# EAGLE design moire_v1.6 (EAGLE 9.2.0)

## Sheet 1 of 2
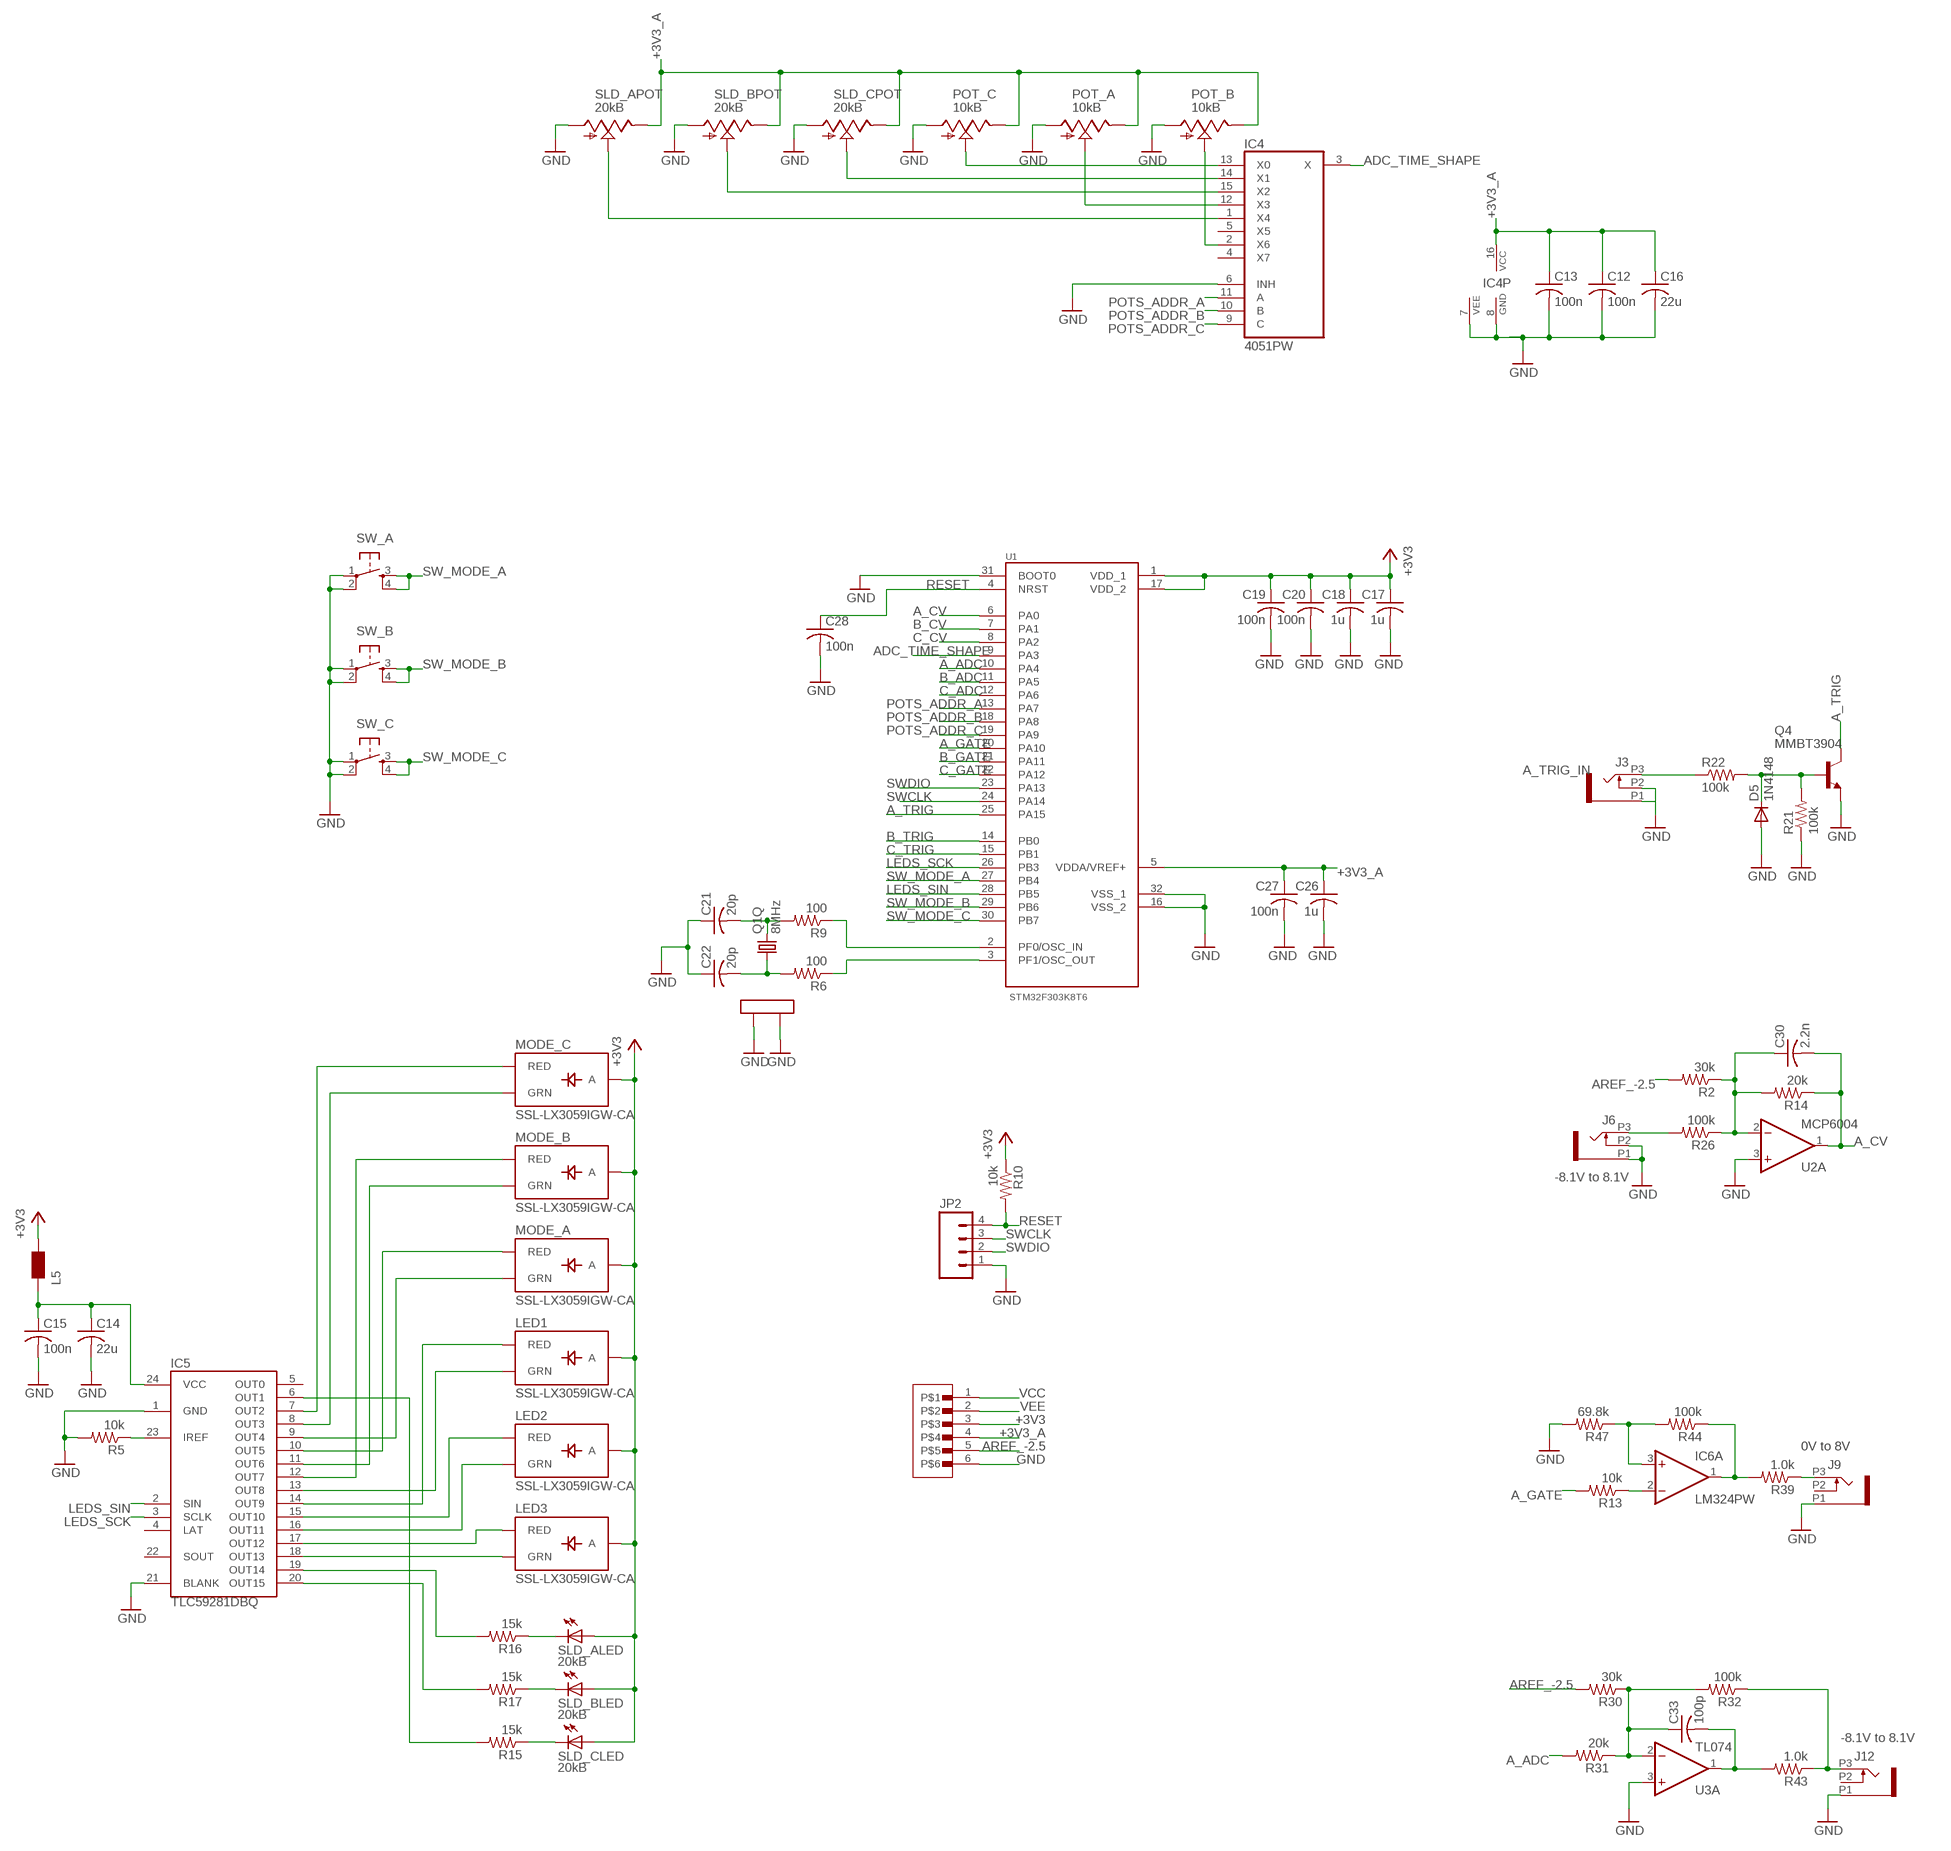
[diagram p0: schematic, sheet 1, part 1 of 2]
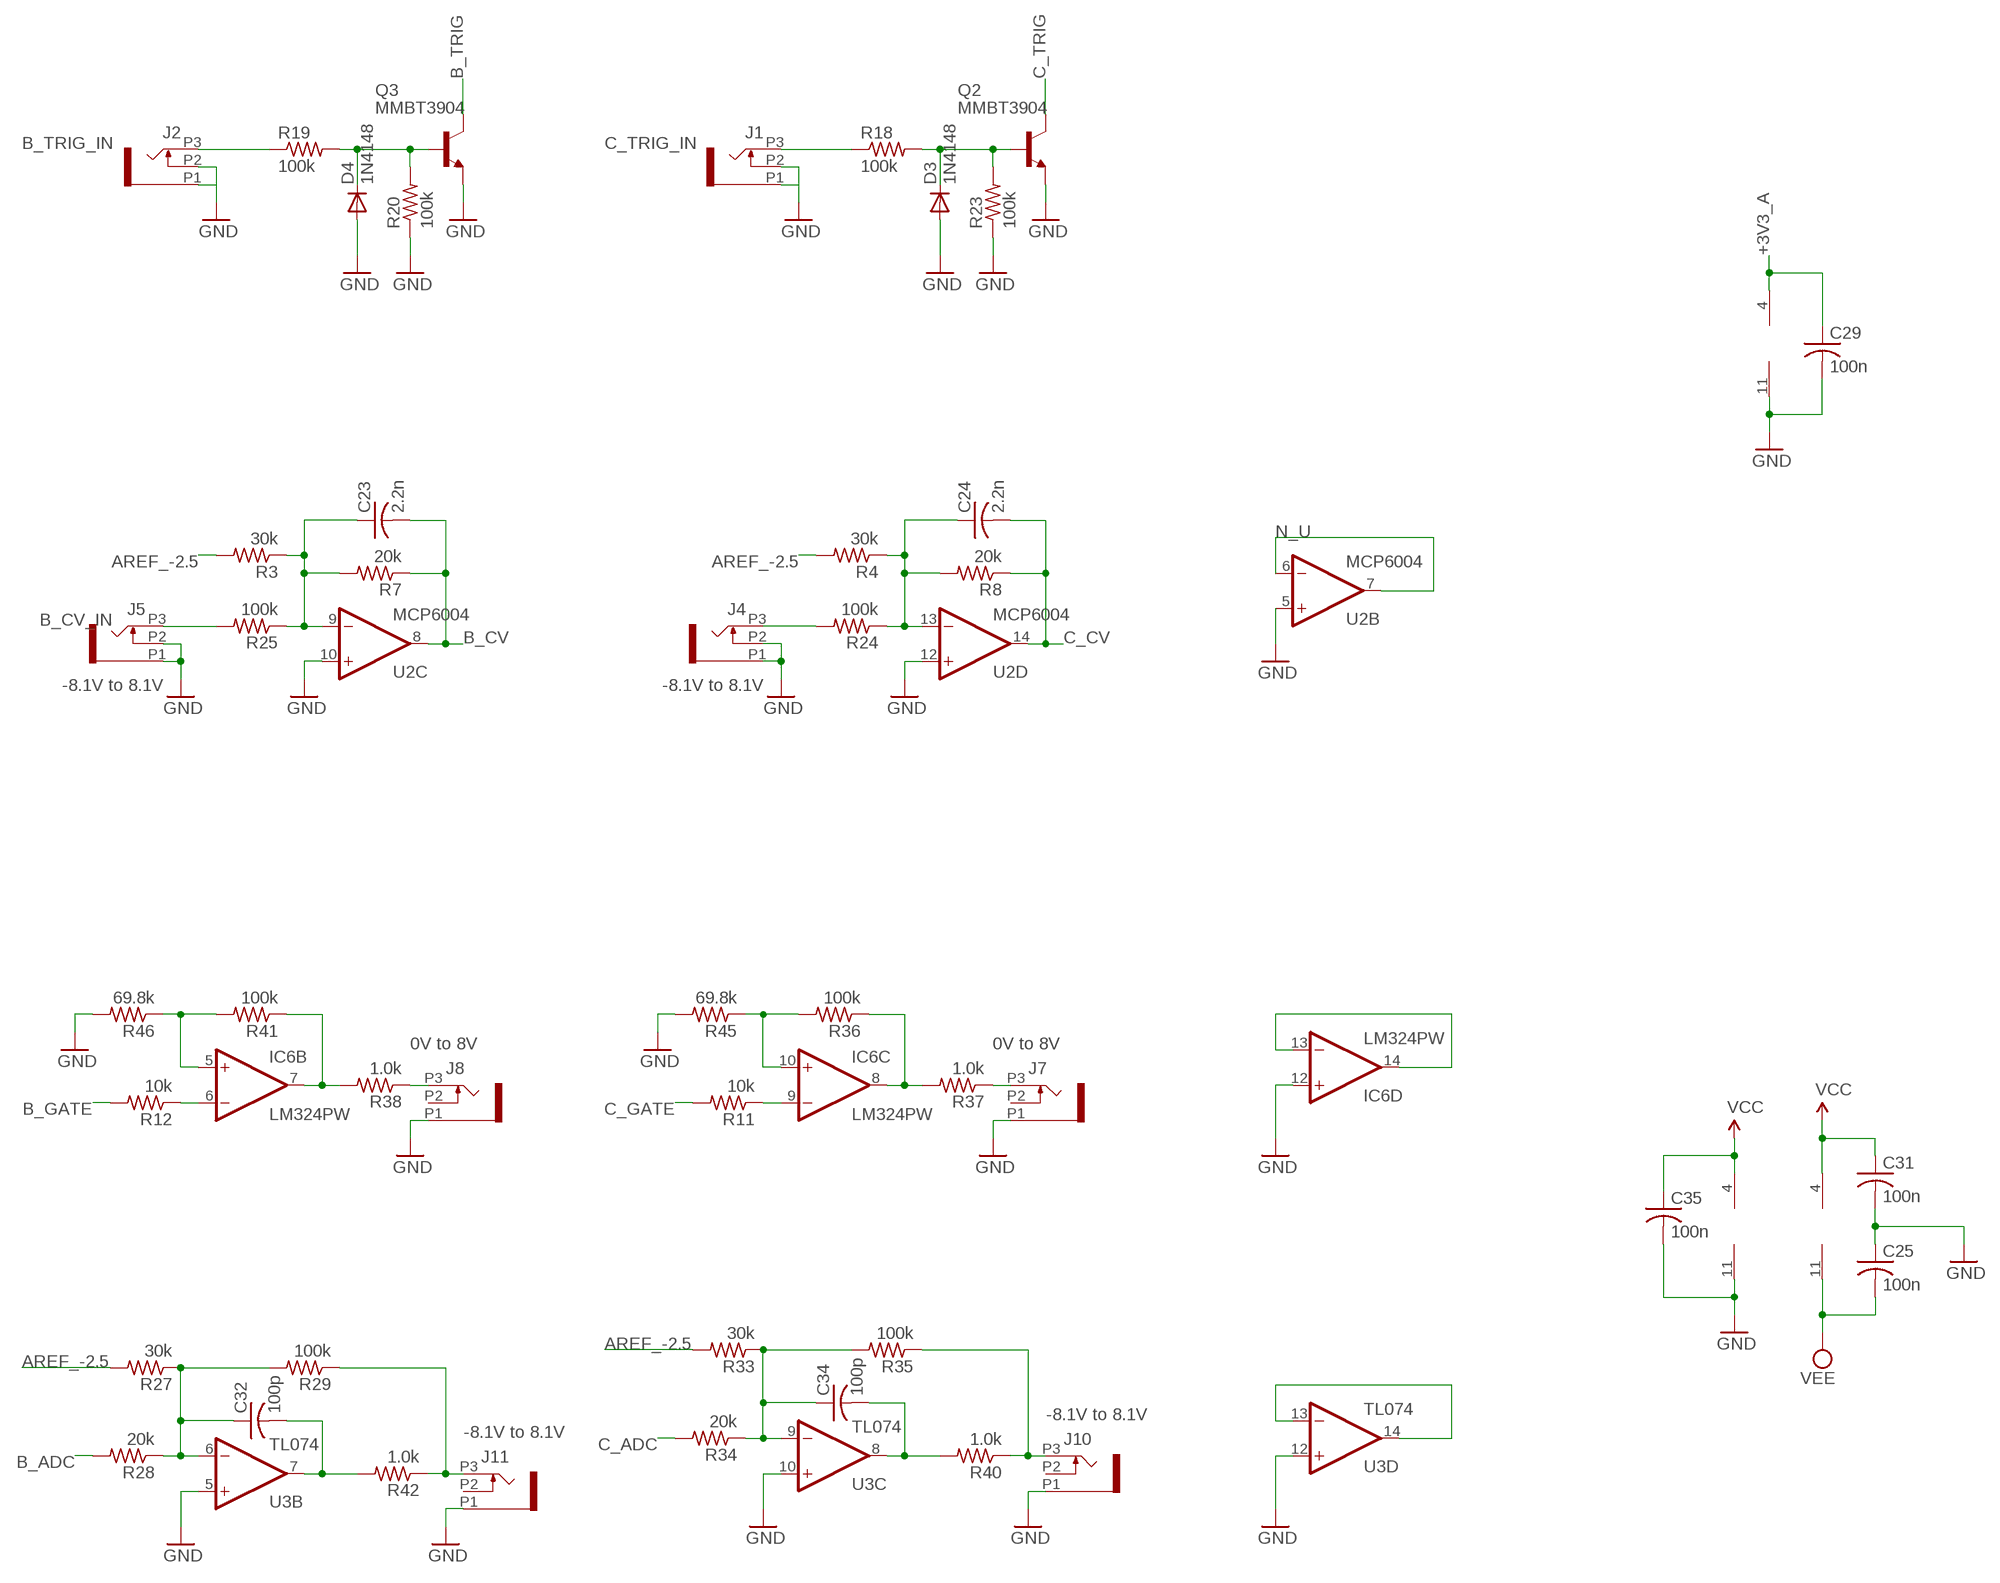
[diagram p1: schematic, sheet 1, part 2 of 2]

### Parts
C12  100n  RCL_C-USC0603  [RCL_C0603]
C13  100n  RCL_C-USC0603  [RCL_C0603]
C14  22u  RCL_C-USC1206  [RCL_C1206]
C15  100n  RCL_C-USC0603  [RCL_C0603]
C16  22u  RCL_C-USC1206  [RCL_C1206]
C17  1u  RCL_C-USC0603  [RCL_C0603]
C18  1u  RCL_C-USC0603  [RCL_C0603]
C19  100n  RCL_C-USC0603  [RCL_C0603]
C20  100n  RCL_C-USC0603  [RCL_C0603]
C21  20p  RCL_C-USC0603  [RCL_C0603]
C22  20p  RCL_C-USC0603  [RCL_C0603]
C23  2.2n  RCL_C-USC0603  [RCL_C0603]
C24  2.2n  RCL_C-USC0603  [RCL_C0603]
C25  100n  RCL_C-USC0603  [RCL_C0603]
C26  1u  RCL_C-USC0603  [RCL_C0603]
C27  100n  RCL_C-USC0603  [RCL_C0603]
C28  100n  RCL_C-USC0603  [RCL_C0603]
C29  100n  RCL_C-USC0603  [RCL_C0603]
C30  2.2n  RCL_C-USC0603  [RCL_C0603]
C31  100n  RCL_C-USC0603  [RCL_C0603]
C32  100p  RCL_C-USC0603  [RCL_C0603]
C33  100p  RCL_C-USC0603  [RCL_C0603]
C34  100p  RCL_C-USC0603  [RCL_C0603]
C35  100n  RCL_C-USC0603  [RCL_C0603]
D3  1N4148  DIODE-SOD523  [SOD523]
D4  1N4148  DIODE-SOD523  [SOD523]
D5  1N4148  DIODE-SOD523  [SOD523]
IC4  4051PW  [TSSOP16_065]
IC5  TLC59281DBQ  [TSSOP24_0635]
IC6  LM324PW  TL074PW  [TSSOP14_065]
J1  PJ301_THONKICONN6  [WQP_PJ_301M6]
J2  PJ301_THONKICONN6  [WQP_PJ_301M6]
J3  PJ301_THONKICONN6  [WQP_PJ_301M6]
J4  PJ301_THONKICONN6  [WQP_PJ_301M6]
J5  PJ301_THONKICONN6  [WQP_PJ_301M6]
J6  PJ301_THONKICONN6  [WQP_PJ_301M6]
J7  PJ301_THONKICONN6  [WQP_PJ_301M6]
J8  PJ301_THONKICONN6  [WQP_PJ_301M6]
J9  PJ301_THONKICONN6  [WQP_PJ_301M6]
J10  PJ301_THONKICONN6  [WQP_PJ_301M6]
J11  PJ301_THONKICONN6  [WQP_PJ_301M6]
J12  PJ301_THONKICONN6  [WQP_PJ_301M6]
JP2  M04PTH  [1X04]
L5  WE-CBF_0603  [0603]
LED1  SSL-LX3059IGW-CA  LED-BICOLOR-THROUGHHOLE-CA  [LED-BICOLOR-THROUGHHOLE-LUMEX]
LED2  SSL-LX3059IGW-CA  LED-BICOLOR-THROUGHHOLE-CA  [LED-BICOLOR-THROUGHHOLE-LUMEX]
LED3  SSL-LX3059IGW-CA  LED-BICOLOR-THROUGHHOLE-CA  [LED-BICOLOR-THROUGHHOLE-LUMEX]
MODE_A  SSL-LX3059IGW-CA  LED-BICOLOR-THROUGHHOLE-CA  [LED-BICOLOR-THROUGHHOLE-LUMEX]
MODE_B  SSL-LX3059IGW-CA  LED-BICOLOR-THROUGHHOLE-CA  [LED-BICOLOR-THROUGHHOLE-LUMEX]
MODE_C  SSL-LX3059IGW-CA  LED-BICOLOR-THROUGHHOLE-CA  [LED-BICOLOR-THROUGHHOLE-LUMEX]
POT_A  10kB  POT_USVERTICAL  [ALPS_POT_VERTICAL]
POT_B  10kB  POT_USVERTICAL  [ALPS_POT_VERTICAL]
POT_C  10kB  POT_USVERTICAL  [ALPS_POT_VERTICAL]
Q1  8MHz  CRYSTAL  [CTS406]
Q2  MMBT3904  MMBT3904LT1-NPN-SOT23-BEC  [SOT23-BEC]
Q3  MMBT3904  MMBT3904LT1-NPN-SOT23-BEC  [SOT23-BEC]
Q4  MMBT3904  MMBT3904LT1-NPN-SOT23-BEC  [SOT23-BEC]
R2  30k  RCL_R-US_R0603  [RCL_R0603]
R3  30k  RCL_R-US_R0603  [RCL_R0603]
R4  30k  RCL_R-US_R0603  [RCL_R0603]
R5  10k  RCL_R-US_R0603  [RCL_R0603]
R6  100  RCL_R-US_R0603  [RCL_R0603]
R7  20k  RCL_R-US_R0603  [RCL_R0603]
R8  20k  RCL_R-US_R0603  [RCL_R0603]
R9  100  RCL_R-US_R0603  [RCL_R0603]
R10  10k  RCL_R-US_R0603  [RCL_R0603]
R11  10k  RCL_R-US_R0603  [RCL_R0603]
R12  10k  RCL_R-US_R0603  [RCL_R0603]
R13  10k  RCL_R-US_R0603  [RCL_R0603]
R14  20k  RCL_R-US_R0603  [RCL_R0603]
R15  15k  RCL_R-US_R0603  [RCL_R0603]
R16  15k  RCL_R-US_R0603  [RCL_R0603]
R17  15k  RCL_R-US_R0603  [RCL_R0603]
R18  100k  RCL_R-US_R0603  [RCL_R0603]
R19  100k  RCL_R-US_R0603  [RCL_R0603]
R20  100k  RCL_R-US_R0603  [RCL_R0603]
R21  100k  RCL_R-US_R0603  [RCL_R0603]
R22  100k  RCL_R-US_R0603  [RCL_R0603]
R23  100k  RCL_R-US_R0603  [RCL_R0603]
R24  100k  RCL_R-US_R0603  [RCL_R0603]
R25  100k  RCL_R-US_R0603  [RCL_R0603]
R26  100k  RCL_R-US_R0603  [RCL_R0603]
R27  30k  RCL_R-US_R0603  [RCL_R0603]
R28  20k  RCL_R-US_R0603  [RCL_R0603]
R29  100k  RCL_R-US_R0603  [RCL_R0603]
R30  30k  RCL_R-US_R0603  [RCL_R0603]
R31  20k  RCL_R-US_R0603  [RCL_R0603]
R32  100k  RCL_R-US_R0603  [RCL_R0603]
R33  30k  RCL_R-US_R0603  [RCL_R0603]
R34  20k  RCL_R-US_R0603  [RCL_R0603]
R35  100k  RCL_R-US_R0603  [RCL_R0603]
R36  100k  RCL_R-US_R0603  [RCL_R0603]
R37  1.0k  RCL_R-US_R0603  [RCL_R0603]
R38  1.0k  RCL_R-US_R0603  [RCL_R0603]
R39  1.0k  RCL_R-US_R0603  [RCL_R0603]
R40  1.0k  RCL_R-US_R0603  [RCL_R0603]
R41  100k  RCL_R-US_R0603  [RCL_R0603]
R42  1.0k  RCL_R-US_R0603  [RCL_R0603]
R43  1.0k  RCL_R-US_R0603  [RCL_R0603]
R44  100k  RCL_R-US_R0603  [RCL_R0603]
R45  69.8k  RCL_R-US_R0603  [RCL_R0603]
R46  69.8k  RCL_R-US_R0603  [RCL_R0603]
R47  69.8k  RCL_R-US_R0603  [RCL_R0603]
SLD_A  20kB  BOURNS_SLIDER  [BOURNS_SLIDER]
SLD_B  20kB  BOURNS_SLIDER  [BOURNS_SLIDER]
SLD_C  20kB  BOURNS_SLIDER  [BOURNS_SLIDER]
SW_A  TAC_SWITCHPTH  [TACTILE-PTH]
SW_B  TAC_SWITCHPTH  [TACTILE-PTH]
SW_C  TAC_SWITCHPTH  [TACTILE-PTH]
U1  STM32F303K8T6  [QFP80P900X900X160-32N]
U2  MCP6004  MCP6004_SMD  [SO14]
U3  TL074  TL074_SMD  [SO14]
U$1  1X6-SMD-TESTPAD  [6X1-SMD-TESTPAD]

### Nets
+3V3 [power]: C17.1 C18.1 C19.1 C20.1 L5.2 LED1.A LED2.A LED3.A MODE_A.A MODE_B.A MODE_C.A R10.1 SLD_A.B(LED:A) SLD_B.B(LED:A) SLD_C.B(LED:A) U1.1(VDD_1) U1.17(VDD_2) U$1.3 ; also sheet 2
+3V3_A [power]: C12.1 C13.1 C16.1 C26.1 C27.1 C29.1 IC4.16(VCC) POT_A.P$1(E) POT_B.P$1(E) POT_C.P$1(E) SLD_A.3(POT:E) SLD_B.3(POT:E) SLD_C.3(POT:E) U1.5(VDDA/VREF+) U2.4(P:V+) U$1.4 ; also sheet 2
A_ADC: R31.2 U1.10(PA4)
A_CV: C30.2 R14.1 U1.6(PA0) U2.1(A:OUT)
A_GATE: R13.2 U1.20(PA10)
A_TRIG: Q4.C U1.25(PA15)
A_TRIG_IN: J3.P3 R22.1
ADC_TIME_SHAPE: IC4.3(X) U1.9(PA3)
AREF_-2.5: R2.2 R3.2 R4.2 R27.2 R30.2 R33.2 U$1.5 ; also sheet 2
B_ADC: R28.2 U1.11(PA5)
B_CV: C23.2 R7.1 U1.7(PA1) U2.8(C:OUT)
B_CV_IN: J5.P3 R25.2
B_GATE: R12.2 U1.21(PA11)
B_TRIG: Q3.C U1.14(PB0)
B_TRIG_IN: J2.P3 R19.1
C_ADC: R34.2 U1.12(PA6)
C_CV: C24.2 R8.1 U1.8(PA2) U2.14(D:OUT)
C_GATE: R11.2 U1.22(PA12)
C_TRIG: Q2.C U1.15(PB1)
C_TRIG_IN: J1.P3 R18.1
GND: C12.2 C13.2 C14.2 C15.2 C16.2 C17.2 C18.2 C19.2 C20.2 C21.1 C22.1 C25.1 C26.2 C27.2 C28.2 C29.2 C31.2 C35.2 D3.A D4.A D5.A IC4.6(INH) IC4.7(VEE) IC4.8(GND) IC5.1(GND) IC5.21(BLANK) IC6.11(P:V-) IC6.12(D:+IN) J1.P1 J1.P2 J2.P1 J2.P2 J3.P1 J3.P2 J4.P1 J4.P2 J5.P1 J5.P2 J6.P1 J6.P2 J7.P1 J8.P1 J9.P1 J10.P1 J11.P1 J12.P1 JP2.1 POT_A.P$3(A) POT_B.P$3(A) POT_C.P$3(A) Q1.2(LID1) Q1.4(LID2) Q2.E Q3.E Q4.E R5.2 R20.1 R21.1 R23.1 R45.2 R46.2 R47.2 SLD_A.1(POT:A) SLD_B.1(POT:A) SLD_C.1(POT:A) SW_A.1 SW_A.2 SW_B.1 SW_B.2 SW_C.1 SW_C.2 U1.16(VSS_2) U1.31(BOOT0) U1.32(VSS_1) U2.3(A:+IN) U2.5(B:+IN) U2.10(C:+IN) U2.11(P:V-) U2.12(D:+IN) U3.3(A:+IN) U3.5(B:+IN) U3.10(C:+IN) U3.12(D:+IN) U$1.6 ; also sheet 2
LEDS_SCK: IC5.3(SCLK) U1.26(PB3)
LEDS_SIN: IC5.2(SIN) U1.28(PB5)
N$1: R15.1 SLD_C.E(LED:C)
N$2: J9.P3 R39.1
N$6: IC6.13(D:-IN) IC6.14(D:OUT)
N$7: J11.P3 R29.1 R42.1
N$8: C32.1 R27.1 R28.1 R29.2 U3.6(B:-IN)
N$9: R9.1 U1.2(PF0/OSC_IN)
N$10: R6.1 U1.3(PF1/OSC_OUT)
N$11: C21.2 Q1.3 R9.2
N$12: C22.2 Q1.1 R6.2
N$13: J8.P3 R38.1
N$14: U3.13(D:-IN) U3.14(D:OUT)
N$15: C32.2 R42.2 U3.7(B:OUT)
N$16: IC6.1(A:OUT) R39.2 R44.1
N$17: J10.P3 R35.1 R40.1
N$18: C34.1 R33.1 R34.1 R35.2 U3.9(C:-IN)
N$19: C34.2 R40.2 U3.8(C:OUT)
N$20: J7.P3 R37.1
N$21: J4.P3 R24.2
N$22: J6.P3 R26.2
N$24: IC6.3(A:+IN) R44.2 R47.1
N$25: IC6.2(A:-IN) R13.1
N$26: IC6.7(B:OUT) R38.2 R41.1
N$28: IC6.5(B:+IN) R41.2 R46.1
N$29: IC6.6(B:-IN) R12.1
N$30: IC6.8(C:OUT) R36.1 R37.2
N$32: IC5.11(OUT6) MODE_B.GREEN_C(GRN)
N$33: IC5.10(OUT5) MODE_A.RED_C(RED)
N$34: IC5.12(OUT7) MODE_B.RED_C(RED)
N$35: IC5.7(OUT2) MODE_C.RED_C(RED)
N$36: IC5.8(OUT3) MODE_C.GREEN_C(GRN)
N$37: IC5.15(OUT10) LED2.RED_C(RED)
N$38: IC5.16(OUT11) LED2.GREEN_C(GRN)
N$39: IC5.13(OUT8) LED1.GREEN_C(GRN)
N$40: IC5.17(OUT12) LED3.RED_C(RED)
N$41: D3.C Q2.B R18.2 R23.2
N$42: IC5.18(OUT13) LED3.GREEN_C(GRN)
N$43: IC5.14(OUT9) LED1.RED_C(RED)
N$44: C14.1 C15.1 IC5.24(VCC) L5.1
N$45: IC5.19(OUT14) R16.2
N$46: IC5.20(OUT15) R17.2
N$47: IC5.6(OUT1) R15.2
N$48: IC4.1(X4) SLD_A.2(POT:S)
N$49: R17.1 SLD_B.E(LED:C)
N$50: R16.1 SLD_A.E(LED:C)
N$51: IC4.2(X6) POT_B.P$2(S)
N$53: IC4.12(X3) POT_A.P$2(S)
N$54: IC4.13(X0) POT_C.P$2(S)
N$55: IC4.14(X1) SLD_C.2(POT:S)
N$56: IC4.15(X2) SLD_B.2(POT:S)
N$57: C30.1 R2.1 R14.2 R26.1 U2.2(A:-IN)
N$58: C23.1 R3.1 R7.2 R25.1 U2.9(C:-IN)
N$59: C24.1 R4.1 R8.2 R24.1 U2.13(D:-IN)
N$61: IC6.10(C:+IN) R36.2 R45.1
N$62: D4.C Q3.B R19.2 R20.2
N$64: IC6.9(C:-IN) R11.1
N$65: D5.C Q4.B R21.2 R22.2
N$68: IC5.23(IREF) R5.1
N$86: J12.P3 R32.1 R43.1
N$87: C33.1 R30.1 R31.1 R32.2 U3.2(A:-IN)
N$93: C33.2 R43.2 U3.1(A:OUT)
N$101: IC5.9(OUT4) MODE_A.GREEN_C(GRN)
N_U: U2.6(B:-IN) U2.7(B:OUT)
POTS_ADDR_A: IC4.11(A) U1.13(PA7)
POTS_ADDR_B: IC4.10(B) U1.18(PA8)
POTS_ADDR_C: IC4.9(C) U1.19(PA9)
RESET: C28.1 JP2.4 R10.2 U1.4(NRST)
SW_MODE_A: SW_A.3 SW_A.4 U1.27(PB4)
SW_MODE_B: SW_B.3 SW_B.4 U1.29(PB6)
SW_MODE_C: SW_C.3 SW_C.4 U1.30(PB7)
SWCLK: JP2.3 U1.24(PA14)
SWDIO: JP2.2 U1.23(PA13)
VCC: C31.1 C35.1 IC6.4(P:V+) U3.4(P:V+) U$1.1 ; also sheet 2
VEE: C25.2 U3.11(P:V-) U$1.2 ; also sheet 2
Unconnected: IC4.4(X7) IC4.5(X5) IC5.4(LAT) IC5.5(OUT0) IC5.22(SOUT) J7.P2 J8.P2 J9.P2 J10.P2 J11.P2 J12.P2

### Notes on the sheet
- -8.1V to 8.1V | -8.1V to 8.1V | -8.1V to 8.1V
- 0V to 8V | 0V to 8V | 0V to 8V
- -8.1V to 8.1V
- -8.1V to 8.1V | -8.1V to 8.1V

## Sheet 2 of 2
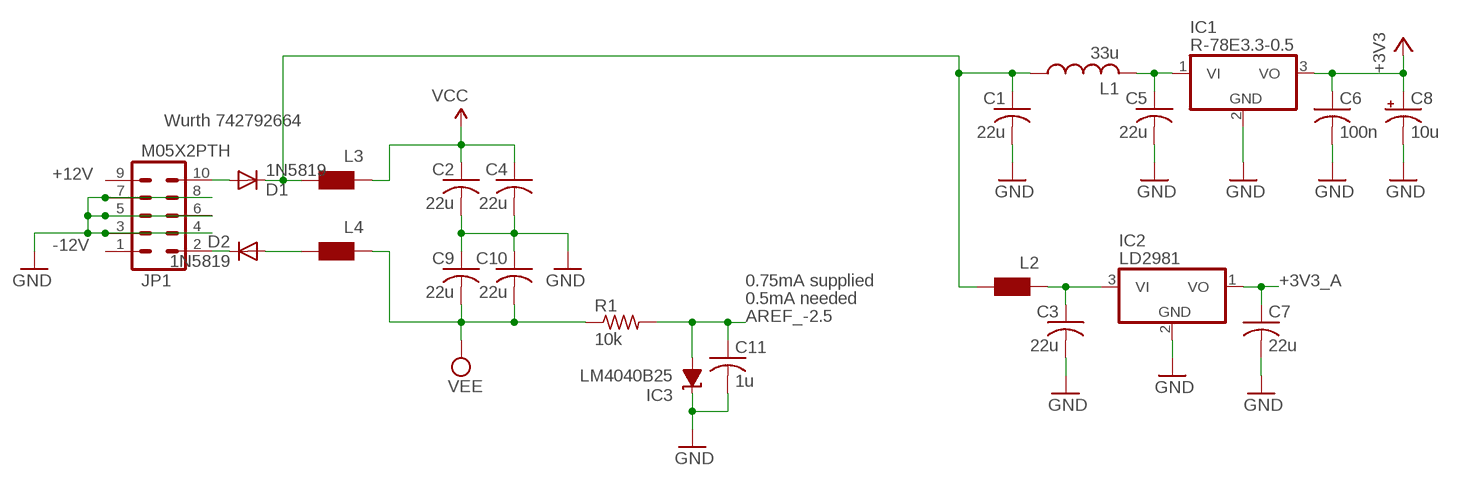
[diagram p2: schematic, sheet 2]

### Parts
C1  22u  RCL_C-USC1206  [RCL_C1206]
C2  22u  RCL_C-USC1206  [RCL_C1206]
C3  22u  RCL_C-USC1206  [RCL_C1206]
C4  22u  RCL_C-USC1206  [RCL_C1206]
C5  22u  RCL_C-USC1206  [RCL_C1206]
C6  100n  RCL_C-USC0603  [RCL_C0603]
C7  22u  RCL_C-USC1206  [RCL_C1206]
C8  10u  RCL_CPOL-USA  [RCL_PANASONIC_A]
C9  22u  RCL_C-USC1206  [RCL_C1206]
C10  22u  RCL_C-USC1206  [RCL_C1206]
C11  1u  RCL_C-USC0603  [RCL_C0603]
D1  1N5819  DIODE-SOD123  [SOD123]
D2  1N5819  DIODE-SOD123  [SOD123]
IC1  R-78E3.3-0.5  WE173950378  [WE78]
IC2  LD2981  LD2981ABU  [SOT89]
IC3  LM4040B25  LM4041B12DBZ  [DBZ_R-PDSO-G3]
JP1  M05X2PTH  [2X5-PTH]
L1  33u  L-USL2012C  [L2012C]
L2  WE-CBF_0603  [0603]
L3  WE-CBF_0603  [0603]
L4  WE-CBF_0603  [0603]
R1  10k  RCL_R-US_R0603  [RCL_R0603]

### Nets
+3V3 [power]: C6.1 C8.+ IC1.3(VO) ; also sheet 1
+3V3_A [power]: C7.1 IC2.1(VO) ; also sheet 1
+12V [power]: D1.A JP1.9 JP1.10
-12V [power]: D2.C JP1.1 JP1.2
AREF_-2.5: C11.1 IC3.2(A) R1.2 ; also sheet 1
GND: C1.2 C2.2 C3.2 C4.2 C5.2 C6.2 C7.2 C8.- C9.1 C10.1 C11.2 IC1.2(GND) IC2.2(GND) IC3.1(C) JP1.3 JP1.4 JP1.5 JP1.6 JP1.7 JP1.8 ; also sheet 1
N$3: D2.A L4.2
N$4: C1.1 D1.C L1.1 L2.2 L3.2
N$5: C3.1 IC2.3(VI) L2.1
N$66: C5.1 IC1.1(VI) L1.2
VCC: C2.1 C4.1 L3.1 ; also sheet 1
VEE: C9.2 C10.2 L4.1 R1.1 ; also sheet 1

### Notes on the sheet
- Wurth 742792664
- 0.75mA supplied
- 0.5mA needed

## Library data of the parts
C1-C7 C9-C35 = moire_v1.5-routed:RCL_C-US: CAPACITOR, American symbol
C8 = moire_v1.5-routed:RCL_CPOL-US: POLARIZED CAPACITOR, American symbol
D1-D5 = diode:DIODE-: DIODE
IC1 = og-vreg:WE173950378
IC2 = og-vreg:LD2981
IC3 = texas:LM4041: PRECISION MICROPOWER SHUNT VOLTAGE REFERENCE Source: http://focus.ti.com/lit/ds/slcs146e/slcs146e.pdf
IC4 = og-ics:4051: 8-channel ANALOG MULTIPLEXER
IC5 = og-ics:TLC59281
IC6 = og-linear:TL074: OP AMP
J1-J12 = og-pj301_variations:PJ301_THONKICONN
JP1 = og-header:M05X2: Header 5x2 Standard 10-pin dual row 0.1" header. Commonly used with AVR-ISP. Use with Spark Fun Electronics SKU: PRT-00778
JP2 = SparkFun:M04: Header 4 Standard 4-pin 0.1" header. Use with straight break away headers (SKU : PRT-00116), right angle break away headers (PRT-00553), swiss pins (PRT-00743), machine pins (PRT-00117), and female headers (PRT-00115). Molex polarized connector foot print use with SKU : PRT-08231 with associated crimp pins and housings.
L1 = og-rcl:L-US
L2-L5 = wuerth-elektronik:WE-CBF: SMD EMI Suppression Ferrite Beads - excellent anti-EMI properties - low DCR - impedances till 3000 ohms - rated current up to 6 A
LED1-LED3 MODE_A MODE_B MODE_C = og-leds:LED-BICOLOR-THROUGHHOLE-CA
POT_A POT_B POT_C = og-pots:POT_US
Q1 = og-crystal:CRYSTAL: Crystal with 2 extra terminals for the metal LID (Abracon ABMM2 for example)
Q2-Q4 = transistor:*-NPN-: NPN Transistror BF959 corrected 2008.03.06
R1-R47 = moire_v1.5-routed:RCL_R-US_: RESISTOR, American symbol
SLD_A SLD_B SLD_C = og-pots:BOURNS_SLIDER
SW_A SW_B SW_C = SparkFun:TAC_SWITCH: Momentary Switch Button commonly used for reset or general input. Spark Fun Electronics SKU : COM-00097
U1 = STM32F303K8T6:STM32F303K8T6: Analog and DSP with FPU ARM Cortex-M4 MCU with 64 Kbytes Flash, 72 MHz CPU, CCM, 12-bit ADC 5 MSPS, comparators, op-amp; AVAILABILITY: Unavailable; DESCRIPTION: Analog and DSP with FPU ARM Cortex-M4 MCU with 64 Kbytes Flash, 72 MHz CPU, CCM, 12-bit ADC 5 MSPS, comparators, op-amp; MF: STMicroelectronics; MP: STM32F303K8T6; PACKAGE: LQFP-32 STMicroelectronics; PRICE: None
U2 = MusicThingModular:MCP6004: Generic Quad Op Amp
U3 = MusicThingModular:TL074: Generic Quad Op Amp
U$1 = CUSTOM:1X6-SMD-TESTPAD

## Net classes
1 power: width 0.406 mm

## Board
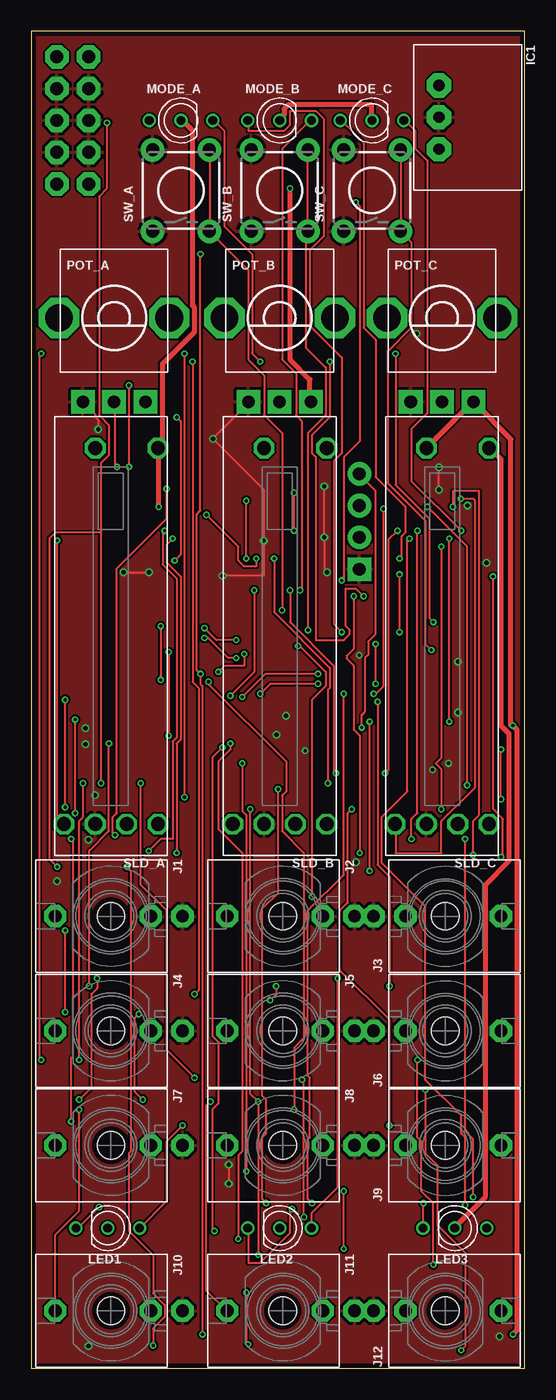
[diagram p3: board, top side]
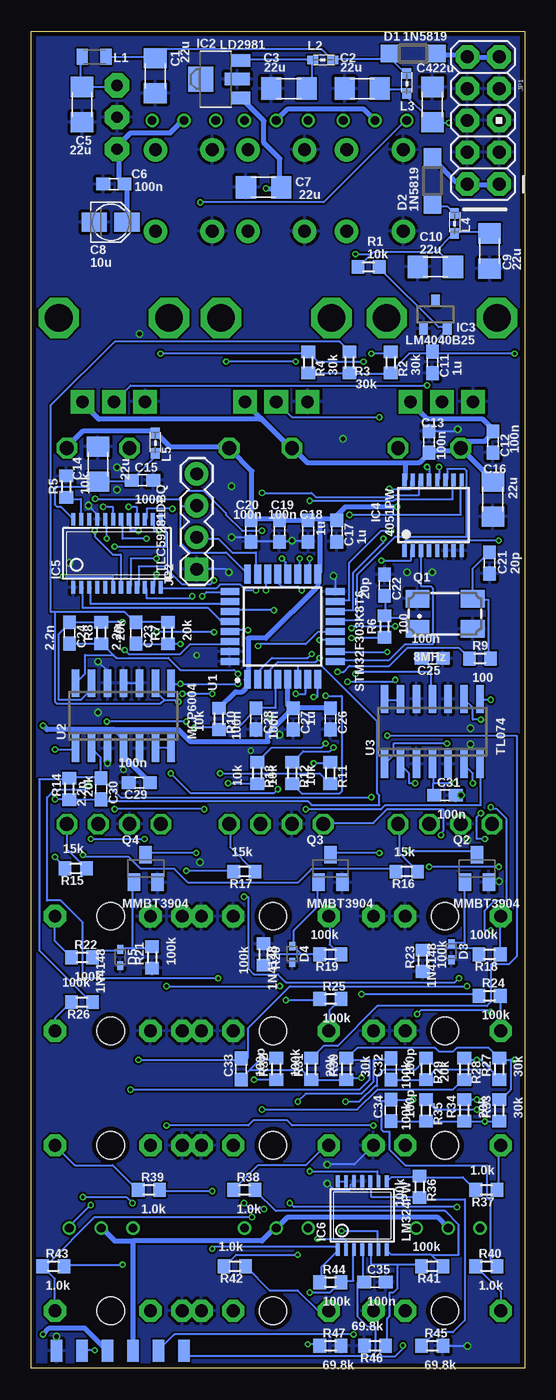
[diagram p4: board, bottom side, seen from below]

Size 39.35 x 106.68 mm. Coordinates in mm from the lower left corner, seen from the top.
Outline: 0,0 39.35,0 39.35,106.68 0,106.68 0,0
Copper layers (1*16): Top 0.035559375mm / dielectric 1.6mm / Bottom 0.035559375mm
Design rules "oshpark-2layer *": minimum track width 6mil, minimum drill 10mil, track to track 6mil, track to pad 6mil, pad to pad 6mil, via to via 6mil, smd to smd 0mil, copper to edge 15mil, drill to drill 6mil, minimum pad ring 5mil, minimum via ring 5mil, stop-mask expansion 2.5mil, vias tented up to drill 0mil, thermal gap 10mil

### Footprints (pad centres in the part's own frame; a part is rotated, then mirrored left to right if it is on the bottom)
RCL_C1206 = smd 1.6 x 1.8: 1 -1.4,0; 2 1.4,0
RCL_C0603 = smd 1.1 x 1: 1 -0.85,0; 2 0.85,0
RCL_PANASONIC_A = smd 2 x 1.5: + 1.3,0; - -1.3,0
SOD123 = smd 1.4 x 1.4: A 1.9,0; C -1.9,0
SOD523 = smd 0.7 x 0.5: A 0.7,0; C -0.6,0
WE78 = drill 0.9 pad 1.93 octagon: 1 -2.54,0; 2 0,0; 3 2.54,0
SOT89 = smd 1 x 1.5: 1 -1.499,-1.981; 3 1.499,-1.981 | smd 1 x 2: 2 0,-1.727 | smd 2 x 2: 2@1 0,1.194
DBZ_R-PDSO-G3 = smd 0.7 x 1: 1 -0.95,-1.1; 2 0.95,-1.1; 3 0,1.1
TSSOP16_065 = smd 0.35 x 1: 1 -1.95,-2.825; 2 -1.3,-2.825; 3 -0.65,-2.825; 4 0,-2.825; 5 0.65,-2.825; 6 1.3,-2.825; 7 1.95,-2.825; 8 2.6,-2.825; 9 2.6,2.825; 10 1.95,2.825; 11 1.3,2.825; 12 0.65,2.825; 13 0,2.825; 14 -0.65,2.825; 15 -1.3,2.825; 16 -1.95,2.825
TSSOP24_0635 = smd 0.33 x 1: 1 -3.493,-2.725; 2 -2.857,-2.725; 3 -2.223,-2.725; 4 -1.587,-2.725; 5 -0.953,-2.725; 6 -0.318,-2.725; 7 0.318,-2.725; 8 0.953,-2.725; 9 1.587,-2.725; 10 2.223,-2.725; 11 2.857,-2.725; 12 3.493,-2.725; 13 3.493,2.725; 14 2.857,2.725; 15 2.223,2.725; 16 1.587,2.725; 17 0.953,2.725; 18 0.318,2.725; 19 -0.318,2.725; 20 -0.953,2.725; 21 -1.587,2.725; 22 -2.223,2.725; 23 -2.857,2.725; 24 -3.493,2.725
TSSOP14_065 = smd 0.305 x 0.991: 1 -1.95,-2.718; 2 -1.3,-2.718; 3 -0.65,-2.718; 4 0,-2.718; 5 0.65,-2.718; 6 1.3,-2.718; 7 1.95,-2.718; 8 1.95,2.718; 9 1.3,2.718; 10 0.65,2.718; 11 0,2.718; 12 -0.65,2.718; 13 -1.3,2.718; 14 -1.95,2.718
WQP_PJ_301M6 = drill 1.016 pad 1.778 octagon: P1 0,-5.715; P2 0,-3.175; P3 0,4.445 | hole 2.2: 0,0
2X5-PTH = drill 1.016 pad 1.88 octagon: 1 -1.27,5.08; 2 1.27,5.08; 3 -1.27,2.54; 4 1.27,2.54; 5 -1.27,0; 6 1.27,0; 7 -1.27,-2.54; 8 1.27,-2.54; 9 -1.27,-5.08; 10 1.27,-5.08
1X04 = drill 1.016 pad 1.88 square: 1 0,0 | drill 1.016 pad 1.88: 2 2.54,0; 3 5.08,0; 4 7.62,0
L2012C = smd 0.9 x 1.25: 1 -0.9,0; 2 1,0
0603 = smd 0.85 x 0.7: 1 -0.9,0; 2 0.7,0
LED-BICOLOR-THROUGHHOLE-LUMEX = drill 0.7: A 0,0; GREEN_C 2.54,0; RED_C -2.54,0
ALPS_POT_VERTICAL = drill 1 pad 1.88 square: P$1 -2.5,6.7; P$2 0,6.7; P$3 2.5,6.7 | drill 2.2 pad 3.175 octagon: P$4 -4.4,0; P$5 4.4,0
CTS406 = smd 1.9 x 1.4: 1 -2.2,-1.2; 2 2.2,-1.2; 3 2.2,1.2; 4 -2.2,1.2
SOT23-BEC = smd 1 x 1.4: B -0.95,-1.1; C 0,1.1; E 0.95,-1.1
RCL_R0603 = smd 1 x 1.1: 1 -0.85,0; 2 0.85,0
BOURNS_SLIDER = drill 1.1 octagon: 1 -15,1.25; 2 -15,3.75; 3 15,1.25; B 15,-3.75; DUMMY -15,-1.25; E -15,-3.75
TACTILE-PTH = drill 1.016 pad 1.88: 1 -3.251,2.261; 2 3.251,2.261; 3 -3.251,-2.261; 4 3.251,-2.261
QFP80P900X900X160-32N = smd 1.5 x 0.55: 1 -4.2,2.8; 2 -4.2,2; 3 -4.2,1.2; 4 -4.2,0.4; 5 -4.2,-0.4; 6 -4.2,-1.2; 7 -4.2,-2; 8 -4.2,-2.8; 17 4.2,-2.8; 18 4.2,-2; 19 4.2,-1.2; 20 4.2,-0.4; 21 4.2,0.4; 22 4.2,1.2; 23 4.2,2; 24 4.2,2.8 | smd 0.55 x 1.5: 9 -2.8,-4.2; 10 -2,-4.2; 11 -1.2,-4.2; 12 -0.4,-4.2; 13 0.4,-4.2; 14 1.2,-4.2; 15 2,-4.2; 16 2.8,-4.2; 25 2.8,4.2; 26 2,4.2; 27 1.2,4.2; 28 0.4,4.2; 29 -0.4,4.2; 30 -1.2,4.2; 31 -2,4.2; 32 -2.8,4.2
SO14 = smd 0.6 x 2.2: 1 -3.81,-2.6; 2 -2.54,-2.6; 3 -1.27,-2.6; 4 0,-2.6; 5 1.27,-2.6; 6 2.54,-2.6; 7 3.81,-2.6; 8 3.81,2.6; 9 2.54,2.6; 10 1.27,2.6; 11 0,2.6; 12 -1.27,2.6; 13 -2.54,2.6; 14 -3.81,2.6
6X1-SMD-TESTPAD = smd 0.914 x 1.778: 1 0,0.123; 2 -2.032,0.123; 3 -4.064,0.123; 4 -6.096,0.123; 5 -8.128,0.123; 6 -10.16,0.123

### Placement (x,y rotation side)
C1  29.46,103.12 270 bottom
C2  12.95,102.11 180 bottom
C3  18.8,102.11 180 bottom
C4  7.37,100.84 90 bottom
C5  35.31,100.84 270 bottom
C6  32.77,94.49 180 bottom
C7  20.83,94.23 180 bottom
C8  33.02,91.44 0 bottom
C9  2.79,89.15 90 bottom
C10  7.11,87.88 0 bottom
C11  7.37,80.26 270 bottom
C12  2.54,73.91 270 bottom
C13  7.62,73.91 90 bottom
C14  34.04,72.14 90 bottom
C15  30.48,70.87 0 bottom
C16  2.54,69.34 270 bottom
C17  14.99,66.8 270 bottom
C18  17.27,66.8 270 bottom
C19  19.56,66.8 270 bottom
C20  21.84,66.8 270 bottom
C21  2.79,64.26 90 bottom
C22  11.18,62.48 270 bottom
C23  30.99,58.67 270 bottom
C24  36.32,58.67 270 bottom
C25  7.37,56.64 180 bottom
C26  15.49,51.82 270 bottom
C27  18.46,51.82 270 bottom
C28  21.42,51.82 270 bottom
C29  30.73,46.74 180 bottom
C30  33.78,46.23 270 bottom
C31  6.35,45.72 0 bottom
C32  10.67,23.88 90 bottom
C33  22.61,23.88 90 bottom
C34  10.67,20.57 90 bottom
C35  11.94,6.86 0 bottom
D1  8.89,104.9 0 bottom
D2  7.37,94.74 270 bottom
D3  5.84,33.27 270 bottom
D4  18.54,33.07 270 bottom
D5  32.26,32.83 270 bottom
IC1  32.51,99.82 270 top
IC2  24.64,102.87 90 bottom
IC3  7.11,84.07 0 bottom
IC4  7.62,68.07 0 bottom
IC5  32.51,65.02 0 bottom
IC6  12.95,12.19 0 bottom
J1  6.35,36.07 90 top
J2  20.07,36.07 90 top
J3  33.02,36.07 270 top
J4  6.35,26.92 90 top
J5  20.07,26.92 90 top
J6  33.02,26.92 270 top
J7  6.35,17.78 90 top
J8  20.07,17.78 90 top
J9  33.02,17.78 270 top
J10  6.35,4.57 90 top
J11  20.07,4.57 90 top
J12  33.02,4.57 270 top
JP1  3.3,99.57 180 bottom
JP2  26.16,63.75 90 bottom
L1  34.29,104.65 180 bottom
L2  16,104.39 0 bottom
L3  9.4,102.62 90 bottom
L4  5.59,91.44 90 bottom
L5  29.46,73.91 90 bottom
LED1  6.1,11.18 0 top
LED2  19.81,11.18 0 top
LED3  33.78,11.18 0 top
MODE_A  11.94,99.57 180 top
MODE_B  19.81,99.57 180 top
MODE_C  27.18,99.57 180 top
POT_A  6.6,83.82 180 top
POT_B  19.81,83.82 180 top
POT_C  32.77,83.82 180 top
Q1  6.35,60.2 0 bottom
Q2  3.81,39.88 0 bottom
Q3  15.49,39.88 0 bottom
Q4  30.23,39.88 0 bottom
R1  12.45,87.88 0 bottom
R2  10.67,80.26 270 bottom
R3  13.97,80.26 270 bottom
R4  17.27,80.26 270 bottom
R5  36.58,70.36 90 bottom
R6  11.18,59.18 90 bottom
R7  28.45,58.67 90 bottom
R8  33.78,58.67 90 bottom
R9  3.56,56.64 0 bottom
R10  24.38,51.82 270 bottom
R11  15.49,47.5 270 bottom
R12  18.54,47.5 270 bottom
R13  21.34,47.5 270 bottom
R14  36.32,46.23 90 bottom
R15  35.81,39.88 180 bottom
R16  9.4,39.62 180 bottom
R17  22.35,39.62 180 bottom
R18  2.79,33.02 180 bottom
R19  15.49,33.02 180 bottom
R20  20.83,33.02 270 bottom
R21  29.72,32.77 90 bottom
R22  35.31,32.77 0 bottom
R23  8.13,32.51 90 bottom
R24  2.79,29.72 0 bottom
R25  15.49,29.46 0 bottom
R26  35.31,29.21 180 bottom
R27  2.03,23.88 90 bottom
R28  4.83,23.88 270 bottom
R29  7.87,23.88 270 bottom
R30  14.22,23.88 90 bottom
R31  17.02,23.88 90 bottom
R32  19.81,23.88 90 bottom
R33  2.03,20.57 90 bottom
R34  4.83,20.57 90 bottom
R35  7.87,20.57 270 bottom
R36  8.38,14.48 270 bottom
R37  3.05,14.22 180 bottom
R38  22.35,14.22 0 bottom
R39  29.97,14.22 0 bottom
R40  3.05,8.13 0 bottom
R41  7.37,8.13 180 bottom
R42  23.11,8.13 180 bottom
R43  37.59,8.13 0 bottom
R44  15.49,6.86 0 bottom
R45  7.37,1.78 0 bottom
R46  11.94,1.78 180 bottom
R47  15.49,1.78 0 bottom
SLD_A  6.35,58.42 90 top
SLD_B  19.81,58.42 90 top
SLD_C  32.77,58.42 90 top
SW_A  11.94,93.98 90 top
SW_B  19.81,93.98 90 top
SW_C  27.18,93.98 90 top
U1  19.3,59.18 90 bottom
U2  32,52.07 0 bottom
U3  7.37,50.8 0 bottom
U$1  27.18,1.27 0 bottom

### Tracks (layer width: path | path; a pad name or v marks a point on that pad's centre or on a via)
+3V3  (via drill 0.25)
  Top 0.406: MODE_B.A 19.84,99.69 20.16,100.01 20.16,100.49 20.48,100.81 27.15,100.81 27.15,99.69 MODE_C.A | v10.16,68.74 10.16,73.34 SLD_A.B 10.32,73.34 10.48,73.5 10.48,80.17 13.02,82.71 13.02,84.61 12.86,84.77 12.86,98.74 12.06,99.54 MODE_A.A | LED3.A 33.81,11.27 36.2,13.65 36.2,38.58 38.1,40.48 38.1,50.64 37.47,51.28 37.47,72.55 36.67,73.34 SLD_C.B
  Bottom 0.406: 31.27,10.16 31.27,1.43 U$1.3 | 31.27,10.16 32.7,10.16 33.66,11.11 LED3.A | LED1.A 6.99,12.06 18.89,12.06 19.68,11.27 LED2.A 20,11.11 20.95,10.16 31.27,10.16 | MODE_A.A 12.86,100.49 18.89,100.49 MODE_B.A | C8.+ 31.75,91.44 31.75,94.3 31.91,94.3 C6.1 32.07,94.61 32.38,94.93 32.38,97.16 IC1.3 32.54,97.47 31.43,98.58 28.26,98.58 27.3,99.54 MODE_C.A | SLD_C.B 36.51,73.5 35.24,74.77 29.53,74.77 L5.2 29.37,74.61 28.26,73.5 23.65,73.5 SLD_B.B 23.5,73.34 21.75,71.6 21.75,67.94 C20.1 21.75,67.79 19.68,67.79 C19.1 19.37,67.63 17.46,67.63 C18.1 17.14,67.79 16.35,67.79 | 16.35,67.79 15.08,67.79 C17.1 15.08,67.94 14.29,68.74 v10.16,68.74 | 16.35,67.79 16.35,63.5 U1.17 16.51,63.18 16.51,62.39 20.64,58.26 22.07,58.26 22.07,55.09 U1.1 22.23,54.93 22.23,54.29 22.54,53.98 23.07,53.98 R10.1
+3V3_A  (via drill 0.25)
  Top 0.406: SLD_C.3 31.59,73.5 35.24,77.15 POT_C.P$1 35.4,76.99 38.26,74.14 38.26,51.28 v38.42,51.28 38.73,50.96 38.73,3.02 v38.42,2.7 | v20.64,94.14 20.64,80.49 22.23,78.9 22.23,77.15 POT_B.P$1
  Bottom 0.406: IC2.1 22.54,101.28 20.8,99.54 20.8,97.79 19.53,96.52 19.53,94.3 C7.1 19.53,94.14 v20.64,94.14 | 9.53,72.23 9.53,70.96 IC4.16 | 9.53,72.23 8.41,72.23 7.62,73.03 C13.1 7.46,73.18 5.08,73.18 SLD_A.3 | SLD_A.3 5.08,73.5 4.6,73.98 3.17,73.98 2.54,74.61 C12.1 2.54,74.93 3.33,75.72 7.78,75.72 9.05,76.99 POT_A.P$1 | 9.53,72.23 17.3,72.23 18.41,73.34 SLD_B.3 18.73,73.5 21.03,75.8 | 21.03,75.8 22.23,76.99 POT_B.P$1 | POT_C.P$1 35.24,76.99 33.97,75.72 21.11,75.72 21.03,75.8 | C26.1 15.56,52.7 18.41,52.7 C27.1 | U1.5 18.89,54.93 18.89,52.86 18.41,52.86 C27.1 | C29.1 30,46.83 31.91,48.74 31.91,49.37 U2.4 32.07,49.53 32.07,50.32 32.7,50.96 | v38.42,2.7 37.91,3.21 35.12,3.21 33.34,1.43 U$1.4 | v38.42,51.28 38.1,50.96 32.7,50.96 | 32.7,50.96 27.62,50.96 26.67,50.01 20.48,50.01 20.48,50.64 18.57,52.55 C27.1 | SLD_A.3 2.54,70.86 C16.1
+12V
  Bottom 0.406: D1.A 6.99,104.78 4.6,104.78 JP1.10 4.45,104.62 2.06,104.62 JP1.9
-12V
  Bottom 0.406: D2.C 7.3,96.52 5.4,94.61 4.6,94.61 JP1.2 4.45,94.46 2.06,94.46 JP1.1
A_ADC  (via drill 0.25)
  Top 0.152: v10.95,57.15 v10.95,50.48
  Bottom 0.152: v10.95,50.48 0.64,50.48 0.64,32.86 1.27,32.23 2.7,32.23 2.7,29.21 3.02,28.89 11.75,28.89 14.92,25.72 16.03,25.72 16.05,25.7 16.05,25.69 R31.2 | v10.95,57.15 15.08,57.15 U1.10
A_CV  (via drill 0.25)
  Top 0.152: v37.47,45.4 v37.47,49.37
  Bottom 0.152: U1.6 18.1,55.09 18.1,56.04 16.19,56.04 11.75,51.59 11.75,45.88 11.59,45.72 11.59,44.93 16.99,44.93 17.3,45.24 33.66,45.24 C30.2 33.81,45.4 36.2,45.4 R14.1 36.35,45.4 v37.47,45.4 | v37.47,49.37 35.88,49.37 U2.1
A_GATE  (via drill 0.25)
  Top 0.152: v23.65,46.67 23.65,54.13 23.81,54.29 23.81,55.88 19.37,60.33 v19.37,64.61
  Bottom 0.152: v19.37,64.61 19.05,64.29 19.05,63.5 U1.20 | v23.65,46.67 21.34,46.67
A_TRIG  (via drill 0.25)
  Top 0.152: v26.19,41.12 26.19,50.48 25.72,50.96 25.72,56.07 25.15,56.64 25.15,56.83 25.72,57.4 v25.72,61.59
  Bottom 0.152: v26.19,41.12 30.16,41.12 Q4.C | v25.72,61.59 25.4,61.91 23.65,61.91 U1.25
A_TRIG_IN
  Bottom 0.152: R22.1 37.47,34.08 J3.P3
ADC_TIME_SHAPE
  Bottom 0.152: IC4.3 8.26,65.25 8.26,62.39 7.46,62.39 7.3,62.23 7.3,57.78 9.53,57.78 10.79,56.52 15.08,56.52 U1.9
AREF_-2.5  (via drill 0.25)
  Top 0.152: v34.29,1.43 34.61,1.75 34.61,9.21 32.38,11.43 32.38,16.19 31.43,17.14 v31.43,22.23 | v0.79,80.96 0.64,80.8 0.64,24.77 v0.79,24.61
  Bottom 0.152: 13.97,79.38 10.79,79.38 R2.2 10.64,79.53 9.21,80.96 7.46,80.96 C11.1 | 13.97,79.38 14.01,79.38 | R4.2 17.14,79.38 15.24,79.38 14.01,79.38 | 13.97,79.38 R3.2 14.01,79.38 | C11.1 7.3,81.12 7.3,81.76 6.16,82.9 IC3.2 6.25,83.06 6.86,83.06 11.6,87.8 R1.2 | 1.11,24.61 1.11,22.23 1.91,21.42 R33.2 | 1.11,24.61 1.91,24.61 R27.2 2.06,24.77 2.86,25.56 5.4,25.56 5.71,25.24 6.83,25.24 7.14,25.56 13.34,25.56 14.13,24.77 R30.2 14.13,24.61 12.38,24.61 12.38,23.02 13.18,22.23 v31.43,22.23 | v34.29,1.43 35.24,1.43 U$1.5 | v0.79,80.96 7.3,80.96 C11.1 | 1.11,24.61 v0.79,24.61
B_ADC  (via drill 0.25)
  Top 0.152: v20.95,20.64 20.95,25.56 21.75,26.35 21.75,41.12 20,42.86 20,45.72 20.32,46.04 20.32,48.42 14.13,54.61 v14.13,54.77 | v10.32,59.21 v10.32,54.93 | v13.81,59.05 14.76,58.1 v16.35,58.1
  Bottom 0.152: v20.95,20.64 13.34,20.64 11.75,22.23 5.71,22.23 4.91,23.03 R28.2 | v14.13,54.77 10.48,54.77 v10.32,54.93 | v10.32,59.21 13.65,59.21 v13.81,59.05 | v16.35,58.1 15.24,58.1 U1.11
B_CV  (via drill 0.25)
  Top 0.152: v18.26,53.82 19.05,54.61 v22.86,54.61 | v27.46,54.61 v27.46,57.78
  Bottom 0.152: v18.26,53.82 17.46,53.82 17.46,54.93 U1.7 | v22.86,54.61 v27.46,54.61 28.1,54.61 U2.8 | v27.46,57.78 28.42,57.78 R7.1 28.57,57.78 30.95,57.78 C23.2
B_CV_IN
  Bottom 0.152: R25.2 14.76,29.37 15.56,28.57 15.56,26.99 J5.P3
B_GATE  (via drill 0.25)
  Top 0.152: v15.88,53.66 17.78,55.56 v17.78,62.07
  Bottom 0.152: v15.88,53.66 14.61,53.66 14.61,46.04 14.76,45.88 17.78,45.88 R12.2 | v17.78,62.07 18.1,62.39 19.37,62.39 19.68,62.71 19.68,63.34 U1.21
B_TRIG  (via drill 0.25)
  Top 0.152: v11.59,41.12 11.59,49.85 11.91,50.16 11.91,63.18 10.79,64.29 10.79,65.72 v11.27,66.2
  Bottom 0.152: v11.59,41.12 15.4,41.12 Q3.C | v11.27,66.2 11.27,65.88 13.65,63.5 13.65,60.48 15.08,60.48 U1.14
B_TRIG_IN
  Bottom 0.152: J2.P3 15.56,36.04 15.56,33.81 14.76,33.02
C_ADC  (via drill 0.25)
  Top 0.152: v3.81,21.43 4.76,22.38 4.76,29.84 5.24,30.32 v5.24,31.11 | v22.38,37.62 22.38,53.34 23.5,54.45 23.5,55.56 21.43,57.63 v21.27,57.63
  Bottom 0.152: v3.81,21.43 4.76,21.43 R34.2 | v5.24,31.11 5.56,30.8 19.05,30.8 19.68,31.43 21.59,31.43 22.07,31.91 22.07,37.62 v22.38,37.62 | v21.27,57.63 21.11,57.78 17.46,57.78 16.51,58.74 15.24,58.74 U1.12
C_CV  (via drill 0.25)
  Top 0.152: v16.83,53.56 18.67,55.4 v22.86,55.4
  Bottom 0.152: v16.83,53.56 16.51,53.56 16.51,54.93 U1.8 | v22.86,55.4 23.18,55.72 27.46,55.72 28.42,56.67 32.54,56.67 32.8,56.93 | 32.8,56.93 33.66,57.78 R8.1 33.81,57.78 33.85,57.82 C24.2 | 32.8,56.93 35.08,56.93 35.08,55.4 35.72,54.77 U2.14
C_GATE  (via drill 0.25)
  Top 0.152: v24.29,47.47 24.13,47.62 24.13,56.04 20.64,59.53 v20.64,62.07
  Bottom 0.152: v24.29,47.47 16.35,47.47 15.56,46.67 R11.2 | v20.64,62.07 20.64,63.34 U1.22
C_TRIG  (via drill 0.25)
  Top 0.152: v9.37,41.27 10.32,42.23 11.27,42.23 11.27,50.01 11.59,50.32 11.59,63.02 10.48,64.14 10.48,66.67 v10.64,66.83
  Bottom 0.152: v9.37,41.27 3.97,41.27 3.81,41.12 Q2.C | v10.64,66.83 11.43,66.83 13.97,64.29 13.97,61.28 15.08,61.28 U1.15
C_TRIG_IN
  Bottom 0.152: R18.1 1.94,36.03 J1.P3
GND  (via drill 0.25, 0.28, 0.35)
  Top 0.152: 4.57,2.03 v4.57,1.78 | v15.75,16.26 v15.75,14.73 | v7.37,63.5 v9.4,63.5 | POT_A.P$3 5.09,76.13 5.09,75.92 5.33,75.67 v5.33,74.93 | POT_B.P$3 17.31,77 v14.48,74.17 18.54,70.1 v18.54,66.04 18.54,63.25 v15.24,63.25 | v23.6,63.5 23.37,63.73 v23.37,66.29 v23.37,70.36 | v32.51,70.1 v32.51,71.88
  Bottom 0.152: U$1.6 v37.34,2.54 | R45.2 v4.57,1.78 | J7.P1 13.59,16.26 v15.75,16.26 | v15.75,14.73 15.7,14.73 15.15,14.19 14.01,14.19 13.87,14.32 13.87,14.64 IC6.12 | v15.24,63.25 15.1,63.11 U1.16 | v23.37,66.29 22.19,66.29 C20.2 C19.2 18.63,65.95 v18.54,66.04 17.36,66.04 C18.2 | v23.6,63.5 23.85,63.75 JP2.1 | 34.61,68.65 v34.8,68.83 34.1,68.14 IC5.21 | v34.04,56.39 33.27,55.63 U2.12 | U2.11 U2.10 | C13.2 5.5,74.76 v5.33,74.93
  other vias: 30.73,82.55 36.32,64.26 4.32,49.78 4.32,51.05 5.08,45.72 4.57,42.16 2.03,38.86 20.32,52.07 19.56,50.55 34.04,52.32 33.27,48.26 21.84,49.28 26.16,56.9 32,47.75 25.91,40.39
  pour Bottom: 39.88,106.93 0,106.93 -0.76,106.17 -0.76,-0.25 0,-1.02 39.88,-1.02
  pour Top: 0,-1.78 39.37,-1.78 40.39,-0.76 40.39,107.19 39.62,107.95 -0.25,107.95 -2.03,106.17 -2.03,0.25
LEDS_SCK
  Bottom 0.152: IC5.3 34.61,62.23 34.61,60.96 23.81,60.96 23.65,61.12 U1.26
LEDS_SIN
  Bottom 0.152: IC5.2 35.24,62.23 35.24,60.64 25.24,60.64 24.29,59.69 23.65,59.69 U1.28
N$1
  Bottom 0.152: SLD_C.E 36.51,43.34 36.51,41.43 35.77,40.69 35.77,40.68 R15.1
N$2
  Bottom 0.152: J9.P3 35.88,16.19 32.86,16.19 30.89,14.22
N$3
  Bottom 0.152: L4.2 5.71,92.23 6.19,92.71 7.3,92.71 D2.A
N$4
  Bottom 0.152: L1.1 33.34,104.62 29.53,104.62 C1.1 29.37,104.62 28.73,105.25 16.19,105.25 15.4,104.46 L2.2 15.24,104.46 10.64,104.46 | 10.64,104.46 9.53,103.35 L3.2 | 10.64,104.46 10.64,104.78 D1.C 10.64,104.46
N$5
  Bottom 0.152: IC2.3 22.54,104.46 16.99,104.46 L2.1 16.99,104.3 16.99,102.55 17.3,102.23 C3.1
N$6
  Bottom 0.152: IC6.13 14.29,14.92 14.76,14.92 IC6.14
N$7  (via drill 0.25)
  Top 0.152: v14.29,21.27 13.97,20.95 13.97,6.19 15.56,4.6 J11.P3
  Bottom 0.152: R42.1 22.23,8.1 20.32,6.19 18.1,6.19 16.51,4.6 15.72,4.6 J11.P3 | v14.29,21.27 13.18,21.27 11.91,22.54 11.75,22.54 11.75,23.34 11.27,23.81 8.73,23.81 7.82,24.73
N$8  (via drill 0.25)
  Top 0.152: v4.13,46.67 4.13,43.97 3.81,43.66 v3.81,24.61
  Bottom 0.152: C32.1 10.64,23.02 7.94,23.02 R29.2 7.78,23.18 7.14,23.81 2.7,23.81 | 2.7,23.81 3.49,24.61 v3.81,24.61 4.76,24.61 R28.1 | 2.7,23.81 2.03,23.15 R27.1 | v4.13,46.67 4.13,47.47 4.76,48.1 U3.6
N$9  (via drill 0.25)
  Top 0.152: v14.92,55.56 15.4,56.04 16.99,56.04 v16.99,56.99
  Bottom 0.152: v14.92,55.56 14.45,55.56 13.97,56.04 10.79,56.04 9.37,57.47 5.23,57.47 R9.1 | v16.99,56.99 17.3,56.67 20.16,56.67 21.27,55.56 21.27,55.09 U1.2
N$10  (via drill 0.25)
  Top 0.152: v13.81,58.26 14.13,58.26 15.72,56.67 v16.35,56.67
  Bottom 0.152: v16.35,56.67 16.67,56.36 19.68,56.36 20.48,55.56 20.48,55.09 U1.3 | R6.1 11.25,58.26 v13.81,58.26
N$11
  Bottom 0.152: R9.2 2.86,56.79 2.86,61.28 4.13,61.28 Q1.3 4.13,61.44 4.13,63.82 2.83,65.11
N$12
  Bottom 0.152: Q1.1 8.57,59.05 9.37,59.85 10.95,59.85 11.11,60.01 R6.2 11.11,60.17 11.11,61.57 C22.2
N$13
  Bottom 0.152: J8.P3 15.88,17.78 17.46,16.19 21.27,16.19 23.2,14.26 R38.1
N$14
  Bottom 0.152: U3.13 10,53.34 11.11,53.34 U3.14
N$15  (via drill 0.25)
  Top 0.152: v18.1,9.05 v18.1,21.27 17.46,21.91 v17.46,44.61
  Bottom 0.152: v18.1,9.05 23.02,9.05 23.94,8.13 R42.2 | v18.1,21.27 17.46,21.91 13.02,21.91 12.06,22.86 12.06,24.61 10.79,24.61 C32.2 | v17.46,44.61 11.43,44.61 11.11,44.93 3.49,44.93 3.49,48.1 U3.7
N$16  (via drill 0.25)
  Top 0.152: v24.92,9.53 v24.92,14.13
  Bottom 0.152: R44.1 16.19,6.99 16.19,8.1 14.92,9.37 IC6.1 14.92,9.53 15.08,9.68 24.77,9.68 v24.92,9.53 | v24.92,14.13 29.05,14.13 R39.2
N$17  (via drill 0.25)
  Top 0.152: v3.81,20.64 3.81,12.54 1.91,10.64 J10.P3
  Bottom 0.152: J10.P3 1.91,6.13 R40.1 | v3.81,20.64 7.14,20.64 7.87,21.37 R35.1
N$18  (via drill 0.25)
  Top 0.152: v3.49,44.29 v3.49,51.75 | v3.17,42.23 3.33,42.07 3.33,24.92 3.17,24.77 v3.17,19.68
  Bottom 0.152: R33.1 2.06,19.68 v3.17,19.68 4.76,19.68 R34.1 4.92,19.68 7.78,19.68 R35.2 7.94,19.68 10.64,19.68 C34.1 | v3.49,51.75 4.13,51.75 4.13,52.7 4.76,53.34 U3.9 | v3.49,44.29 3.81,43.97 3.81,42.23 v3.17,42.23
N$19  (via drill 0.25)
  Top 0.152: v2.7,44.77 v2.7,53.34 | v2.7,28.42 v2.7,34.92 | v8.57,28.26 8.26,27.94 8.26,22.07 v8.89,21.43
  Bottom 0.152: v2.7,53.34 3.49,53.34 U3.8 | v2.7,44.77 2.54,44.61 2.22,44.61 1.43,43.81 1.43,37.31 2.38,37.31 3.17,36.51 3.17,34.92 v2.7,34.92 | v2.7,28.42 2.86,28.57 8.26,28.57 v8.57,28.26 | v8.89,21.43 10.64,21.43 C34.2 10.79,21.27 11.43,21.27 11.43,19.05 11.27,18.89 10.79,18.89 10.79,17.46 9.53,16.19 3.02,16.19 3.02,13.65 2.7,13.34 2.7,8.63 R40.2
N$20
  Bottom 0.152: J7.P3 2.06,17.78 2.06,14.36 R37.1
N$21
  Bottom 0.152: J4.P3 1.91,29.69 R24.2
N$22
  Bottom 0.152: R26.2 37.47,27.9 J6.P3
N$24  (via drill 0.25)
  Top 0.152: v17.3,1.91 17.14,2.06 v17.14,6.03
  Bottom 0.152: IC6.3 13.65,9.37 13.65,6.99 14.61,6.99 R44.2 14.76,6.83 15.56,6.03 v17.14,6.03 | R47.1 16.47,1.91 v17.3,1.91
N$25  (via drill 0.25)
  Top 0.152: v16.51,10.32 16.51,16.99 16.83,17.3 16.83,41.12 14.92,43.02 14.92,48.42 15.88,49.37 v15.88,49.85
  Bottom 0.152: v16.51,10.32 14.29,10.32 14.29,9.53 IC6.2 | v15.88,49.85 16.19,49.53 20.16,49.53 21.27,48.42 R13.1
N$26
  Bottom 0.152: 7.46,9.05 10.64,9.05 10.95,9.37 IC6.7 | 7.46,9.05 6.67,8.26 R41.1 | 7.46,9.05 5.24,9.05 5.24,11.43 6.35,12.54 19.84,12.54 21.43,14.13 R38.2
N$28
  Bottom 0.152: 10.16,8.26 12.22,8.26 12.22,9.37 IC6.5 | 10.16,8.26 10.16,6.35 10.48,6.03 10.79,6.03 10.79,4.13 10.95,3.97 10.95,1.91 R46.1 | R41.2 8.34,8.26 10.16,8.26
N$29  (via drill 0.25)
  Top 0.152: v14.61,10.95 14.45,11.11 14.45,20.64 14.92,21.11 14.92,26.04 14.45,26.51 14.45,48.74 v15.24,49.53
  Bottom 0.152: v14.61,10.95 11.75,10.95 11.75,9.53 IC6.6 | v15.24,49.53 15.56,49.21 17.68,49.21 R12.1
N$30
  Bottom 0.152: IC6.8 10.95,14.92 10.64,15.24 8.41,15.24 R36.1 8.26,15.24 4.92,15.24 3.97,14.29 R37.2
N$32  (via drill 0.25)
  Top 0.152: v29.37,58.74 v29.37,63.34 | v24.77,58.74 24.13,59.37 24.13,72.39 24.77,73.03 24.77,80.64 22.23,83.19 22.23,89.22 23.34,90.33 23.34,99.69 22.7,100.33 20.64,100.33 20.64,99.22 20.16,98.74 17.3,98.74 17.3,99.54 MODE_B.GREEN_C
  Bottom 0.152: v29.37,63.34 29.53,63.34 29.53,62.39 IC5.11 | v24.77,58.74 v29.37,58.74
N$33  (via drill 0.25)
  Top 0.152: v26.51,61.59 25.88,62.23 25.08,62.23 25.08,59.21 25.4,58.9 25.4,58.58 24.92,58.1 22.7,58.1 22.7,72.71 22.38,73.03 22.38,74.45 23.81,75.88 v23.81,80.33 | v18.26,80.33 17.62,80.96 17.62,88.9 15.4,91.12 15.4,98.74 14.61,99.54 MODE_A.RED_C
  Bottom 0.152: v26.51,61.59 26.67,61.44 30.16,61.44 30.16,62.23 IC5.10 | v18.26,80.33 v23.81,80.33
N$34  (via drill 0.25)
  Top 0.152: v21.43,62.07 21.59,62.23 21.59,75.56 21.11,76.04 21.11,79.38 20,80.49 20,97.31 22.23,99.54 MODE_B.RED_C
  Bottom 0.152: v21.43,62.07 22.23,62.07 22.7,62.55 24.29,62.55 24.61,62.23 28.89,62.23 IC5.12
N$35  (via drill 0.25)
  Top 0.152: v34.29,66.83 30.32,70.8 30.32,74.93 31.59,76.2 31.59,96.36 30.64,97.31 30.64,98.74 29.84,99.54 MODE_C.RED_C
  Bottom 0.152: v34.29,66.83 34.29,66.36 32.86,64.93 32.23,64.93 32.23,62.39 IC5.7
N$36  (via drill 0.25)
  Top 0.152: v29.37,64.61 29.53,64.77 29.53,66.36 29.84,66.67 29.84,68.74 27.46,71.12 27.46,82.07 26.51,83.03 26.51,97.79 24.77,99.54 MODE_C.GREEN_C
  Bottom 0.152: v29.37,64.61 31.43,64.61 31.43,62.39 IC5.8
N$37  (via drill 0.25)
  Top 0.152: v28.1,68.58 28.1,54.45 27.46,53.82 v27.3,53.82 | v24.92,53.82 24.92,39.37 22.07,36.51 22.07,23.34 22.23,23.18 22.23,18.41 22.07,18.26 22.07,13.49 v22.38,13.18 | v20.8,12.7 20.64,12.54 20.64,10.79 18.26,8.41 17.3,8.41 17.3,11.11 LED2.RED_C
  Bottom 0.152: v28.1,68.58 30.16,68.58 30.16,67.79 IC5.15 | v24.92,53.82 v27.3,53.82 | v22.38,13.18 21.91,12.7 v20.8,12.7
N$38  (via drill 0.25)
  Top 0.152: v31.59,68.74 34.77,65.56 v34.77,46.51 | v24.45,31.11 24.45,14.45 22.38,12.38 22.38,11.27 LED2.GREEN_C
  Bottom 0.152: v31.59,68.74 30.96,68.74 30.96,67.79 IC5.16 | v34.77,46.51 35.08,46.2 37.47,46.2 38.1,45.56 38.1,37.31 36.99,37.31 35.24,35.56 35.24,31.11 v24.45,31.11
N$39  (via drill 0.25)
  Top 0.152: v32.7,65.56 32.7,48.7 32.26,48.26 32.7,47.82 v32.7,44.61 | v25.56,44.61 25.24,44.29 25.24,37.15 24.61,36.51 24.61,31.75 28.57,27.78 v28.57,19.37 | v12.06,19.37 10.79,18.1 10.79,13.34 LED1.GREEN_C
  Bottom 0.152: v32.7,65.56 28.57,65.56 28.57,66.99 28.89,67.31 28.89,67.63 IC5.13 | v25.56,44.61 v32.7,44.61 | v12.06,19.37 18.54,19.37 18.99,19.81 21.59,19.81 22.04,19.37 v28.57,19.37
N$40  (via drill 0.25)
  Top 0.152: v30.8,66.83 30.8,44.29 30.32,43.81 v30.32,42.23 | v34.61,42.23 34.61,18.89 35.24,18.26 v35.24,13.65 | v31.27,13.18 31.27,11.27 LED3.RED_C
  Bottom 0.152: v30.8,66.83 31.43,66.83 31.43,67.63 IC5.17 | v34.61,42.23 v30.32,42.23 | v35.24,13.65 31.75,13.65 v31.27,13.18
N$41
  Bottom 0.152: 6.19,33.5 5.87,33.81 D3.C 5.71,33.97 4.76,33.97 4.76,38.73 Q2.B | 7.99,33.5 8.1,33.5 R23.2 7.99,33.5 | 7.99,33.5 6.19,33.5 | R18.2 4.12,33.5 6.19,33.5
N$42  (via drill 0.25)
  Top 0.152: v30.16,66.2 30,66.04 30,46.04 27.94,43.97 27.94,40.32 31.43,36.83 31.43,23.02 34.29,20.16 34.29,18.73 34.61,18.41 v34.61,13.02
  Bottom 0.152: v30.16,66.2 32.07,66.2 32.07,67.63 IC5.18 | v34.61,13.02 36.35,11.27 LED3.GREEN_C
N$43  (via drill 0.25)
  Top 0.152: v29.21,66.83 28.48,66.1 28.48,47.72 v28.23,47.47 | v19.68,46.2 19.68,37.94 18.41,36.67 18.41,21.75 18.73,21.43 18.73,18.73 18.41,18.41 18.41,13.49 v18.73,13.18 | v5.4,12.86 3.65,11.11 LED1.RED_C
  Bottom 0.152: v29.21,66.83 29.53,66.83 29.53,67.63 IC5.14 | v28.23,47.47 26.64,45.88 20,45.88 v19.68,46.2 | v18.73,13.18 18.41,12.86 v5.4,12.86
N$44
  Bottom 0.152: L5.1 29.46,72.73 C15.1 31.39,70.8 33.97,70.8 C14.1 34.13,70.64 34.45,70.33 37.47,70.33 37.47,68.9 37.31,68.74 36.99,68.74 36.04,67.79 IC5.24
N$45  (via drill 0.25)
  Top 0.152: v33.62,68.74 33.62,70.01 35.72,70.01 35.72,44.13 35.24,43.66 v35.24,40.96
  Bottom 0.152: v33.62,68.74 32.86,68.74 32.86,67.79 IC5.19 | v35.24,40.96 35.08,40.8 31.59,40.8 30.64,39.85 27.94,39.85 26.83,38.73 18.1,38.73 16.99,39.85 10.48,39.85 10.32,39.69 R16.2
N$46  (via drill 0.25)
  Top 0.152: v33.34,51.59 v33.34,66.2 | v26.99,39.69 v26.99,51.59
  Bottom 0.152: v33.34,66.2 33.34,67.63 IC5.20 | v26.99,51.59 v33.34,51.59 | v26.99,39.69 23.34,39.69 R17.2
N$47  (via drill 0.25)
  Top 0.152: v36.83,63.18 36.83,44.61 37.62,43.81 37.62,40.96 v37.47,40.8
  Bottom 0.152: v36.83,63.18 32.86,63.18 32.86,62.39 IC5.6 | v37.47,40.8 36.67,40.01 R15.2
N$48  (via drill 0.25)
  Top 0.152: v2.06,66.04 2.06,43.97 2.54,43.5 SLD_A.2
  Bottom 0.152: v2.06,66.04 9.53,66.04 9.53,65.41 IC4.1
N$49
  Bottom 0.152: R17.1 21.59,39.69 23.5,41.59 23.5,43.34 SLD_B.E
N$50
  Bottom 0.152: R16.1 8.57,39.69 10,41.12 10,43.34 SLD_A.E
N$51  (via drill 0.25)
  Top 0.152: v11.43,64.45 11.91,64.93 11.91,75.56 v11.59,75.88
  Bottom 0.152: v11.43,64.45 9.05,64.45 9.05,65.25 IC4.2 | v11.59,75.88 18.57,75.88 19.68,76.99 POT_B.P$2
N$53  (via drill 0.25)
  Top 0.152: v6.83,71.91 6.67,72.07 6.67,76.99 POT_A.P$2
  Bottom 0.152: v6.83,71.91 6.83,70.96 IC4.12
N$54  (via drill 0.25)
  Top 0.152: v7.78,78.42 v7.78,71.91
  Bottom 0.152: IC4.13 7.62,71.91 v7.78,71.91 | v7.78,78.42 31.43,78.42 32.7,77.15 POT_C.P$2
N$55  (via drill 0.25)
  Top 0.152: v20.95,66.83 v20.95,69.85 | v34.26,69.37 35.27,69.37 35.4,69.25 35.4,46.35 32.7,43.66 32.7,41.08 29.05,41.08 29.05,43.34 SLD_C.2
  Bottom 0.152: v20.95,69.85 16.99,69.85 16.67,69.53 10.64,69.53 10.48,69.69 8.41,69.69 8.41,70.8 IC4.14 | v20.95,66.83 22.54,66.83 23.83,68.12 23.83,68.25 25.59,70.01 26.92,70.01 27.56,69.37 v34.26,69.37
N$56  (via drill 0.25)
  Top 0.152: v10.79,70.17 10.79,67.79 6.83,63.82 6.83,44.29 6.51,43.97 6.51,42.7 v6.67,42.55
  Bottom 0.152: v10.79,70.17 9.05,70.17 9.05,70.8 IC4.15 | v6.67,42.55 6.67,42.7 6.51,42.86 6.51,44.61 10.95,44.61 12.06,43.5 16.03,43.5 SLD_B.2
N$57  (via drill 0.25)
  Top 0.152: v12.22,45.56 v12.22,80.96
  Bottom 0.152: R26.1 34.61,29.21 38.73,33.34 38.73,46.99 36.35,46.99 R14.2 36.2,47.15 33.81,47.15 | v12.22,45.56 32.23,45.56 33.66,46.99 C30.1 33.81,47.15 | 33.81,47.15 33.81,48.74 34.45,49.37 U2.2 | R2.1 10.82,80.96 v12.22,80.96
N$58  (via drill 0.25)
  Top 0.152: v19.05,29.37 19.53,29.84 v19.53,30.48 | v28.57,30.48 28.57,39.21 27.62,40.16 v27.62,53.18
  Bottom 0.152: v19.05,29.37 16.35,29.37 R25.1 | v28.57,30.48 v19.53,30.48 | v27.62,53.18 27.78,53.34 28.73,53.34 | 28.73,53.34 29.37,53.98 29.37,54.61 U2.9 | 37.47,60.33 31.91,60.33 31.11,59.53 C23.1 30.96,59.53 R7.2 | 37.47,60.33 37.78,60.33 37.78,76.83 32.7,81.92 14.76,81.92 R3.1 | 28.73,53.34 29.05,53.02 37.31,53.02 37.47,53.18 37.47,60.33
N$59  (via drill 0.25)
  Top 0.152: v13.02,29.84 13.34,30.16 13.34,54.29 12.86,54.77 v12.86,80.33 | v32.07,59.53 31.75,59.85 31.75,67.79 29.05,70.48 v29.05,80.96
  Bottom 0.152: U2.13 34.61,54.61 34.61,54.13 35.4,53.34 37.15,53.34 37.15,58.58 36.35,59.37 C24.1 36.2,59.53 33.81,59.53 R8.2 33.66,59.53 v32.07,59.53 | v12.86,80.33 16.51,80.33 17.14,80.96 R4.1 17.3,80.96 v29.05,80.96 | R24.1 3.77,29.84 v13.02,29.84
N$61
  Bottom 0.152: IC6.10 12.22,14.76 12.22,13.65 8.41,13.65 R36.2 8.26,13.49 4.76,13.49 4.76,3.81 5.71,2.86 7.14,2.86 8.1,1.91 R45.1
N$62
  Bottom 0.152: 17.78,33.02 18.41,33.66 D4.C 18.41,33.81 18.41,34.92 16.51,36.83 16.51,38.73 Q3.B | R19.2 17.78,33.02 | 17.78,33.02 20,33.02 20.85,32.17
N$64  (via drill 0.25)
  Top 0.152: v17.14,15.72 17.14,44.13 16.83,44.45 v16.83,48.26
  Bottom 0.152: v17.14,15.72 11.75,15.72 11.75,14.92 IC6.9 | v16.83,48.26 15.56,48.26 R11.1
N$65
  Bottom 0.152: 31.27,33.5 29.84,33.5 R21.2 | 31.27,33.5 32.23,33.5 D5.C 32.38,33.34 33.89,33.34 R22.2 | 31.27,33.5 31.27,38.73 Q4.B
N$66
  Bottom 0.152: L1.2 35.4,104.62 35.4,102.39 C5.1 35.24,102.23 32.54,102.23 IC1.1
N$68
  Bottom 0.152: IC5.23 35.4,67.79 35.4,69.37 36.51,69.37 R5.1
N$86  (via drill 0.25)
  Top 0.152: v21.59,23.02 21.75,22.86 v21.75,12.06
  Bottom 0.152: J12.P3 37.47,7.14 38.42,8.1 R43.1 38.42,8.26 38.1,8.26 34.29,12.06 v21.75,12.06 | R32.1 19.82,23.02 v21.59,23.02
N$87  (via drill 0.25)
  Top 0.152: v8.73,46.67 8.73,38.58 10.79,36.51 10.79,25.4 v13.02,23.18
  Bottom 0.152: 21.91,23.81 21.11,24.61 19.93,24.61 R32.2 | 21.91,23.81 22.54,23.18 C33.1 | 21.91,23.81 17.78,23.81 17.14,23.18 R31.1 16.99,23.02 14.29,23.02 R30.1 14.13,23.18 v13.02,23.18 | v8.73,46.67 9.21,46.67 9.21,47.47 9.84,48.1 U3.2
N$93  (via drill 0.25)
  Top 0.152: v30.8,24.61 30.8,18.41 31.11,18.1 31.11,14.13 32.07,13.18 v32.07,8.26 | v6.19,49.85 6.19,42.86 4.6,41.27 v4.6,30.48
  Bottom 0.152: v30.8,24.61 22.7,24.61 C33.2 22.54,24.77 22.07,24.77 22.07,27.15 18.73,30.48 v4.6,30.48 | v6.19,49.85 10.48,49.85 10.48,48.9 11.11,48.26 U3.1 | R43.2 36.62,8.26 v32.07,8.26
N$101  (via drill 0.25)
  Top 0.152: v24.77,62.87 24.92,63.02 24.92,72.71 26.19,73.98 26.19,92.71 v25.88,93.03
  Bottom 0.152: v24.77,62.87 25.08,62.55 27.3,62.55 28.73,63.98 30.8,63.98 30.8,62.39 IC5.9 | v25.88,93.03 16.03,93.03 9.53,99.54 MODE_A.GREEN_C
N_U
  Bottom 0.152: U2.7 28.26,49.53 29.37,49.53 U2.6
POTS_ADDR_A
  Bottom 0.152: IC4.11 6.19,70.96 6.19,71.75 4.76,71.75 4.6,71.6 4.6,66.36 10.32,66.36 13.34,63.34 13.34,59.69 15.08,59.69 U1.13
POTS_ADDR_B  (via drill 0.25)
  Top 0.152: v17.14,64.61 v17.14,69.22
  Bottom 0.152: v17.14,69.22 10.48,69.22 10.32,69.37 5.71,69.37 5.71,70.8 IC4.10 | v17.14,64.61 17.14,63.5 17.3,63.5 U1.18
POTS_ADDR_C  (via drill 0.25)
  Top 0.152: v13.97,68.1 16.51,65.56 16.51,64.45 16.99,63.98 17.94,63.98 v17.94,64.61
  Bottom 0.152: v13.97,68.1 5.08,68.1 5.08,70.8 IC4.9 | v17.94,64.61 17.94,63.5 18.1,63.5 U1.19
RESET  (via drill 0.25)
  Top 0.152: v26.35,51.12 26.35,52.13 26.61,52.39 26.61,56.66 26.86,56.91 26.86,57.98 27.46,58.58 27.46,70.01 26.19,71.28 JP2.4
  Bottom 0.152: U1.4 19.84,54.93 19.84,52.7 21.27,52.7 C28.1 21.43,52.55 22.86,51.12 24.29,51.12 R10.2 24.45,51.12 v26.35,51.12
SW_MODE_A  (via drill 0.25)
  Top 0.152: v20,60.48 20,74.61 18.57,76.04 18.57,79.22 17.3,80.49 17.3,87.63 14.29,90.65 SW_A.3 14.29,90.81 14.29,97.16 SW_A.4
  Bottom 0.152: v20,60.48 23.5,60.48 U1.27
SW_MODE_B  (via drill 0.25)
  Top 0.152: v22.07,58.9 22.07,74.61 23.5,76.04 23.5,79.85 21.91,81.44 21.91,90.49 22.07,90.65 SW_B.3 22.07,90.81 22.07,97.16 SW_B.4
  Bottom 0.152: v22.07,58.9 23.5,58.9 U1.29
SW_MODE_C  (via drill 0.25)
  Top 0.152: v31.91,57.31 31.43,57.78 31.43,67.63 28.42,70.64 28.42,81.12 30.32,83.03 30.32,89.85 29.53,90.65 SW_C.3 29.53,90.81 29.53,97.16 SW_C.4
  Bottom 0.152: v31.91,57.31 31.59,56.99 27.46,56.99 26.67,57.78 23.81,57.78 23.65,57.94 U1.30
SWCLK
  Bottom 0.152: U1.24 22.23,63.5 23.81,65.09 26.67,65.09 27.46,65.88 27.46,68.74 26.19,68.74 JP2.3
SWDIO
  Bottom 0.152: U1.23 21.43,63.5 21.43,65.09 23.34,65.09 24.45,66.2 26.04,66.2 JP2.2
VCC  (via drill 0.25)
  Top 0.152: 5.56,66.67 5.56,72.23 6.19,72.87 6.19,75.25 5.4,76.04 5.4,93.5 6.03,94.14 v6.03,99.38 | 5.56,66.67 v5.56,46.67 | v7.62,40.01 7.94,39.69 7.94,17.3 7.78,17.14 7.78,10.95 9.72,9.02 9.72,5.96 10.64,5.04 10.64,4.11 9.72,3.18 v9.72,1.81 | v2.06,40.01 1.43,40.64 1.43,66.2 1.91,66.67 5.56,66.67
  Bottom 0.152: IC6.4 12.86,9.37 12.86,6.99 C35.1 12.86,6.83 13.34,6.83 13.34,4.13 12.54,3.33 11.91,3.33 11.91,1.27 12.22,0.95 | 12.22,0.95 26.83,0.95 27.15,1.27 U$1.1 | 7.3,46.67 7.3,48.1 U3.4 | v5.56,46.67 7.3,46.67 | v6.03,99.38 7.3,99.38 C4.1 7.46,99.54 9.53,101.6 L3.1 9.53,101.76 9.84,102.08 11.52,102.08 C2.1 | 12.22,0.95 10.32,0.95 9.72,1.56 v9.72,1.81 | v2.06,40.01 v7.62,40.01 | C31.1 7.3,45.82 7.3,46.67
VEE  (via drill 0.25)
  Top 0.152: v13.65,2.7 13.65,54.45 13.49,54.61 v13.49,55.4 13.18,55.72 13.18,68.1 13.49,68.42 v13.49,88.9
  Bottom 0.152: C9.2 2.86,90.65 5.56,90.65 L4.1 5.71,90.49 7.14,89.06 | 12.22,88.9 12.06,89.06 7.14,89.06 | 12.22,88.9 13.18,87.95 R1.1 | 7.14,89.06 6.83,89.06 5.71,87.95 C10.2 | 7.46,55.56 7.46,53.5 U3.11 | 7.46,55.56 7.46,55.88 8.1,56.52 C25.2 | v13.65,2.7 27.94,2.7 29.21,1.43 U$1.2 | v13.49,55.4 13.34,55.56 7.46,55.56 | v13.49,88.9 12.22,88.9